# EAGLE design mote+cc3200v7 (EAGLE 9.6.2)

## Sheet 1 of 4: CC3200
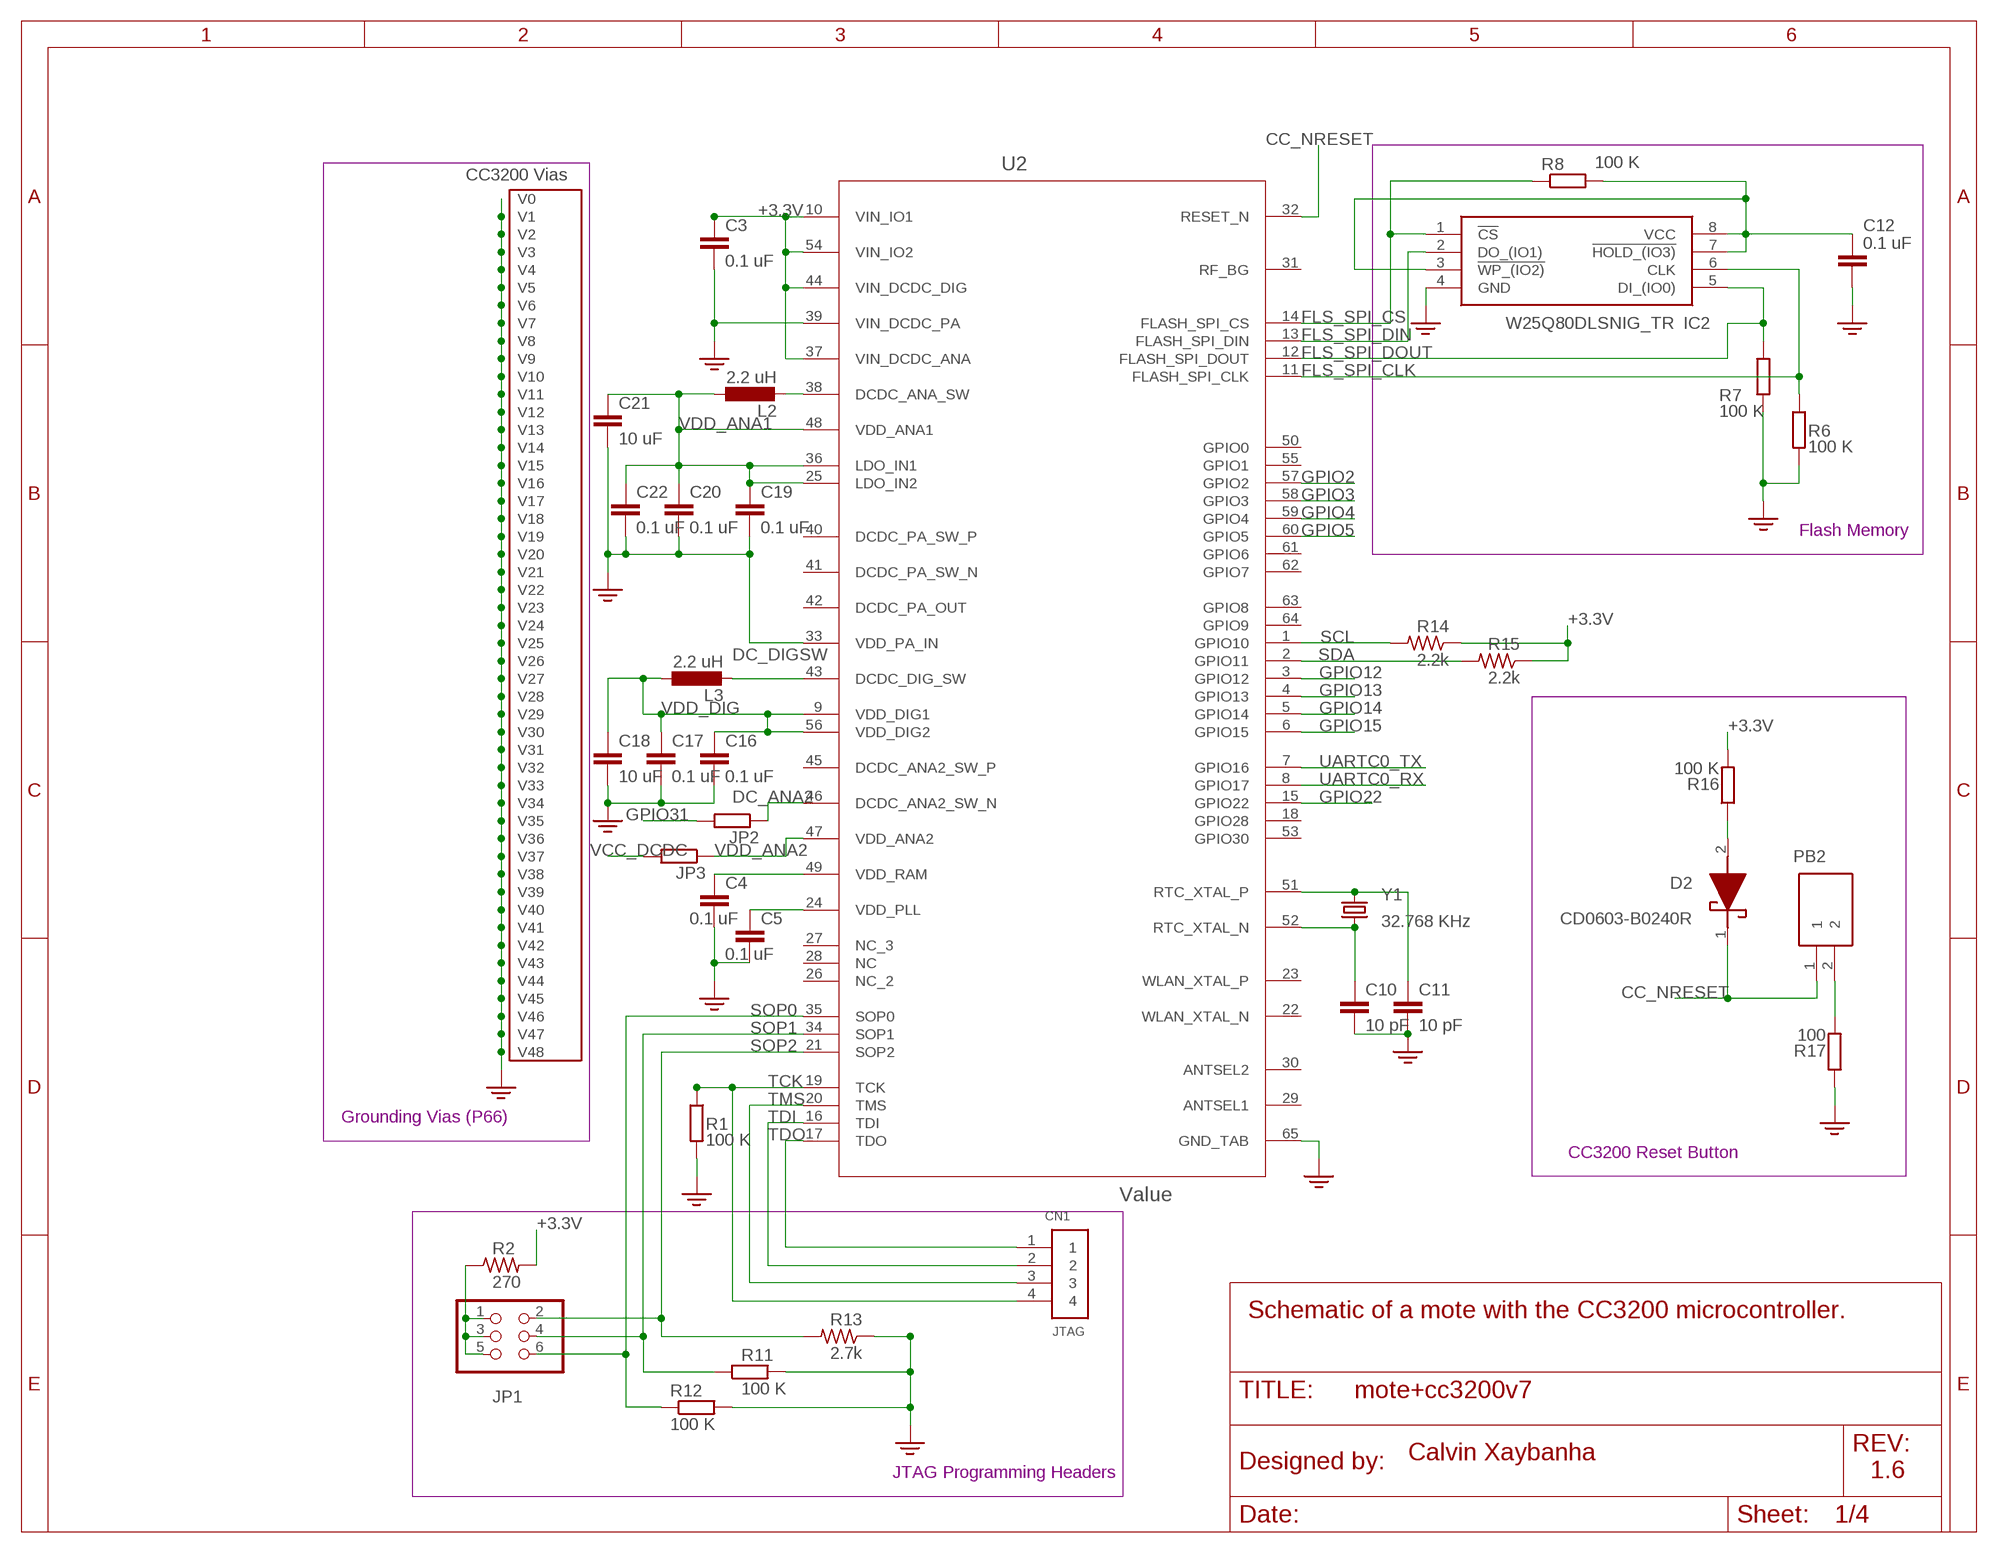
[diagram p0: schematic, sheet 1]
FRAME1 (FRAME_8.5X11): SPICEPREFIX: X

### Parts
C3  0.1 uF  C-EUC1808  [C1808]
C4  0.1 uF  C-EUC1808  [C1808]
C5  0.1 uF  C-EUC1808  [C1808]
C10  10 pF  CC1808  [C1808]
C11  10 pF  CC1808  [C1808]
C12  0.1 uF  C-EUC1808  [C1808]
C16  0.1 uF  C-EUC1808  [C1808]
C17  0.1 uF  C-EUC1808  [C1808]
C18  10 uF  CC1808  [C1808]
C19  0.1 uF  C-EUC1808  [C1808]
C20  0.1 uF  C-EUC1808  [C1808]
C21  10 uF  CC1808  [C1808]
C22  0.1 uF  C-EUC1808  [C1808]
CN1  JTAG  1X4-BIG  [1X04-BIG]
D2  CD0603-B0240R  [CD0603B0240R]
IC2  W25Q80DLSNIG_TR  [SOIC127P600X175-8N]
JP1  PINHD-2X3/90  [2X03/90]
JP2  RR0201  [R0201]
JP3  RR0201  [R0201]
L2  2.2 uH  L-EUL3216C  [L3216C]
L3  2.2 uH  L-EUL3216C  [L3216C]
PB2  FSMSM  [FSMSM]
R1  100 K  R-EU_R1206  [R1206]
R2  270  WSLP1206R0500FEA  [RES_1206]
R6  100 K  R-EU_R1206  [R1206]
R7  100 K  R-EU_R1206  [R1206]
R8  100 K  R-EU_R1206  [R1206]
R11  100 K  R-EU_R1206  [R1206]
R12  100 K  R-EU_R1206  [R1206]
R13  2.7k  WSLP1206R0500FEA  [RES_1206]
R14  2.2k  WSLP1206R0500FEA  [RES_1206]
R15  2.2k  WSLP1206R0500FEA  [RES_1206]
R16  100 K  R-EU_R1206  [R1206]
R17  100  R-EU_R1206  [R1206]
U2  Value  CC3200R1M2RGCR  [RGC0064A]
Y1  32.768 KHz  KX-13  [7.0X5.0]

### Nets
+3.3V [Power]: C3.1 C12.1 IC2.3(!WP_(IO2)) IC2.7(!HOLD_(IO3)) IC2.8(VCC) R2.2 R8.2 R14.1 R15.1 R16.2 U2.10(VIN_IO1) U2.37(VIN_DCDC_ANA) U2.44(VIN_DCDC_DIG) U2.54(VIN_IO2) ; also sheet 2,3,4
CC_NRESET: D2.1(K) PB2.1 U2.32(RESET_N)
D2_P2: D2.2(A) R16.1
DC_ANA2 [Signals]: JP2.1 U2.46(DCDC_ANA2_SW_N)
DC_DIGSW [Signals]: L3.2 U2.43(DCDC_DIG_SW)
FLS_SPI_CLK [Signals]: IC2.6(CLK) R6.1 U2.11(FLASH_SPI_CLK)
FLS_SPI_CS [Signals]: IC2.1(!CS) R8.1 U2.14(FLASH_SPI_CS)
FLS_SPI_DIN [Signals]: IC2.2(DO_(IO1)) U2.13(FLASH_SPI_DIN)
FLS_SPI_DOUT [Signals]: IC2.5(DI_(IO0)) R7.1 U2.12(FLASH_SPI_DOUT)
GND: C3.2 C4.2 C5.2 C10.2 C11.2 C12.2 C16.2 C17.2 C18.2 C19.2 C20.2 C21.2 C22.2 IC2.4(GND) R1.2 R6.2 R7.2 R11.2 R12.2 R13.1 R17.1 U2.33(VDD_PA_IN) U2.39(VIN_DCDC_PA) U2.65(GND_TAB) U2.V(V0) U2.V_1(V1) U2.V_2(V2) U2.V_3(V3) U2.V_4(V4) U2.V_5(V5) U2.V_6(V6) U2.V_7(V7) U2.V_8(V8) U2.V_9(V9) U2.V_10(V10) U2.V_11(V11) U2.V_12(V12) U2.V_13(V13) U2.V_14(V14) U2.V_15(V15) U2.V_16(V16) U2.V_17(V17) U2.V_18(V18) U2.V_19(V19) U2.V_20(V20) U2.V_21(V21) U2.V_22(V22) U2.V_23(V23) U2.V_24(V24) U2.V_25(V25) U2.V_26(V26) U2.V_27(V27) U2.V_28(V28) U2.V_29(V29) U2.V_30(V30) U2.V_31(V31) U2.V_32(V32) U2.V_33(V33) U2.V_34(V34) U2.V_35(V35) U2.V_36(V36) U2.V_37(V37) U2.V_38(V38) U2.V_39(V39) U2.V_40(V40) U2.V_41(V41) U2.V_42(V42) U2.V_43(V43) U2.V_44(V44) U2.V_45(V45) U2.V_46(V46) U2.V_47(V47) U2.V_48(V48) ; supply symbol labelled GND2 ; also sheet 2,3,4
GPIO2 [Signals]: U2.57(GPIO2) ; also sheet 3
GPIO3 [Signals]: U2.58(GPIO3) ; also sheet 3
GPIO4 [Signals]: U2.59(GPIO4) ; also sheet 3
GPIO5 [Signals]: U2.60(GPIO5) ; also sheet 3
GPIO12 [Signals]: U2.3(GPIO12) ; also sheet 3
GPIO13 [Signals]: U2.4(GPIO13) ; also sheet 3
GPIO14 [Signals]: U2.5(GPIO14) ; also sheet 3
GPIO15 [Signals]: U2.6(GPIO15) ; also sheet 3
GPIO22 [Signals]: U2.15(GPIO22) ; also sheet 4
GPIO31 [Signals]: JP2.2
JP1_PWR: JP1.1 JP1.3 JP1.5 R2.1
L2_ANA [Signals]: L2.2 U2.38(DCDC_ANA_SW)
PB2_2: PB2.2 R17.2
SCL [Signals]: R14.2 U2.1(GPIO10) ; also sheet 3
SDA [Signals]: R15.2 U2.2(GPIO11) ; also sheet 3
SOP0 [Signals]: JP1.6 R12.1 U2.35(SOP0)
SOP1 [Signals]: JP1.4 R11.1 U2.34(SOP1)
SOP2 [Signals]: JP1.2 R13.2 U2.21(SOP2)
TCK [Signals]: CN1.4 R1.1 U2.19(TCK)
TDI [Signals]: CN1.2 U2.16(TDI)
TDO [Signals]: CN1.1 U2.17(TDO)
TMS [Signals]: CN1.3 U2.20(TMS)
UARTC0_RX [Signals]: U2.8(GPIO17) ; also sheet 2
UARTC0_TX [Signals]: U2.7(GPIO16) ; also sheet 2
VCC_DCDC [Signals]: JP3.2
VDD_ANA1 [Signals]: C19.1 C20.1 C21.1 C22.1 L2.1 U2.25(LDO_IN2) U2.36(LDO_IN1) U2.48(VDD_ANA1)
VDD_ANA2 [Signals]: JP3.1 U2.47(VDD_ANA2)
VDD_DIG: C16.1 C17.1 C18.1 L3.1 U2.9(VDD_DIG1) U2.56(VDD_DIG2)
VDD_PULL [Signals]: C5.1 U2.24(VDD_PLL)
VDD_RAM [Signals]: C4.1 U2.49(VDD_RAM)
XTAL1 [Signals]: C11.1 U2.51(RTC_XTAL_P) Y1.3
XTAL2 [Signals]: C10.1 U2.52(RTC_XTAL_N) Y1.1
Unconnected: U2.18(GPIO28) U2.22(WLAN_XTAL_N) U2.23(WLAN_XTAL_P) U2.26(NC_2) U2.27(NC_3) U2.28(NC) U2.29(ANTSEL1) U2.30(ANTSEL2) U2.31(RF_BG) U2.45(DCDC_ANA2_SW_P) U2.50(GPIO0) U2.53(GPIO30) U2.55(GPIO1) U2.61(GPIO6) U2.62(GPIO7) U2.63(GPIO8) U2.64(GPIO9)

### Notes on the sheet
- CC3200 Vias
- Flash Memory
- Grounding Vias (P66)
- CC3200 Reset Button
- Schematic of a mote with the CC3200 microcontroller.
- Calvin Xaybanha
- JTAG Programming Headers | 1.6

## Sheet 2 of 4: Smart Mesh
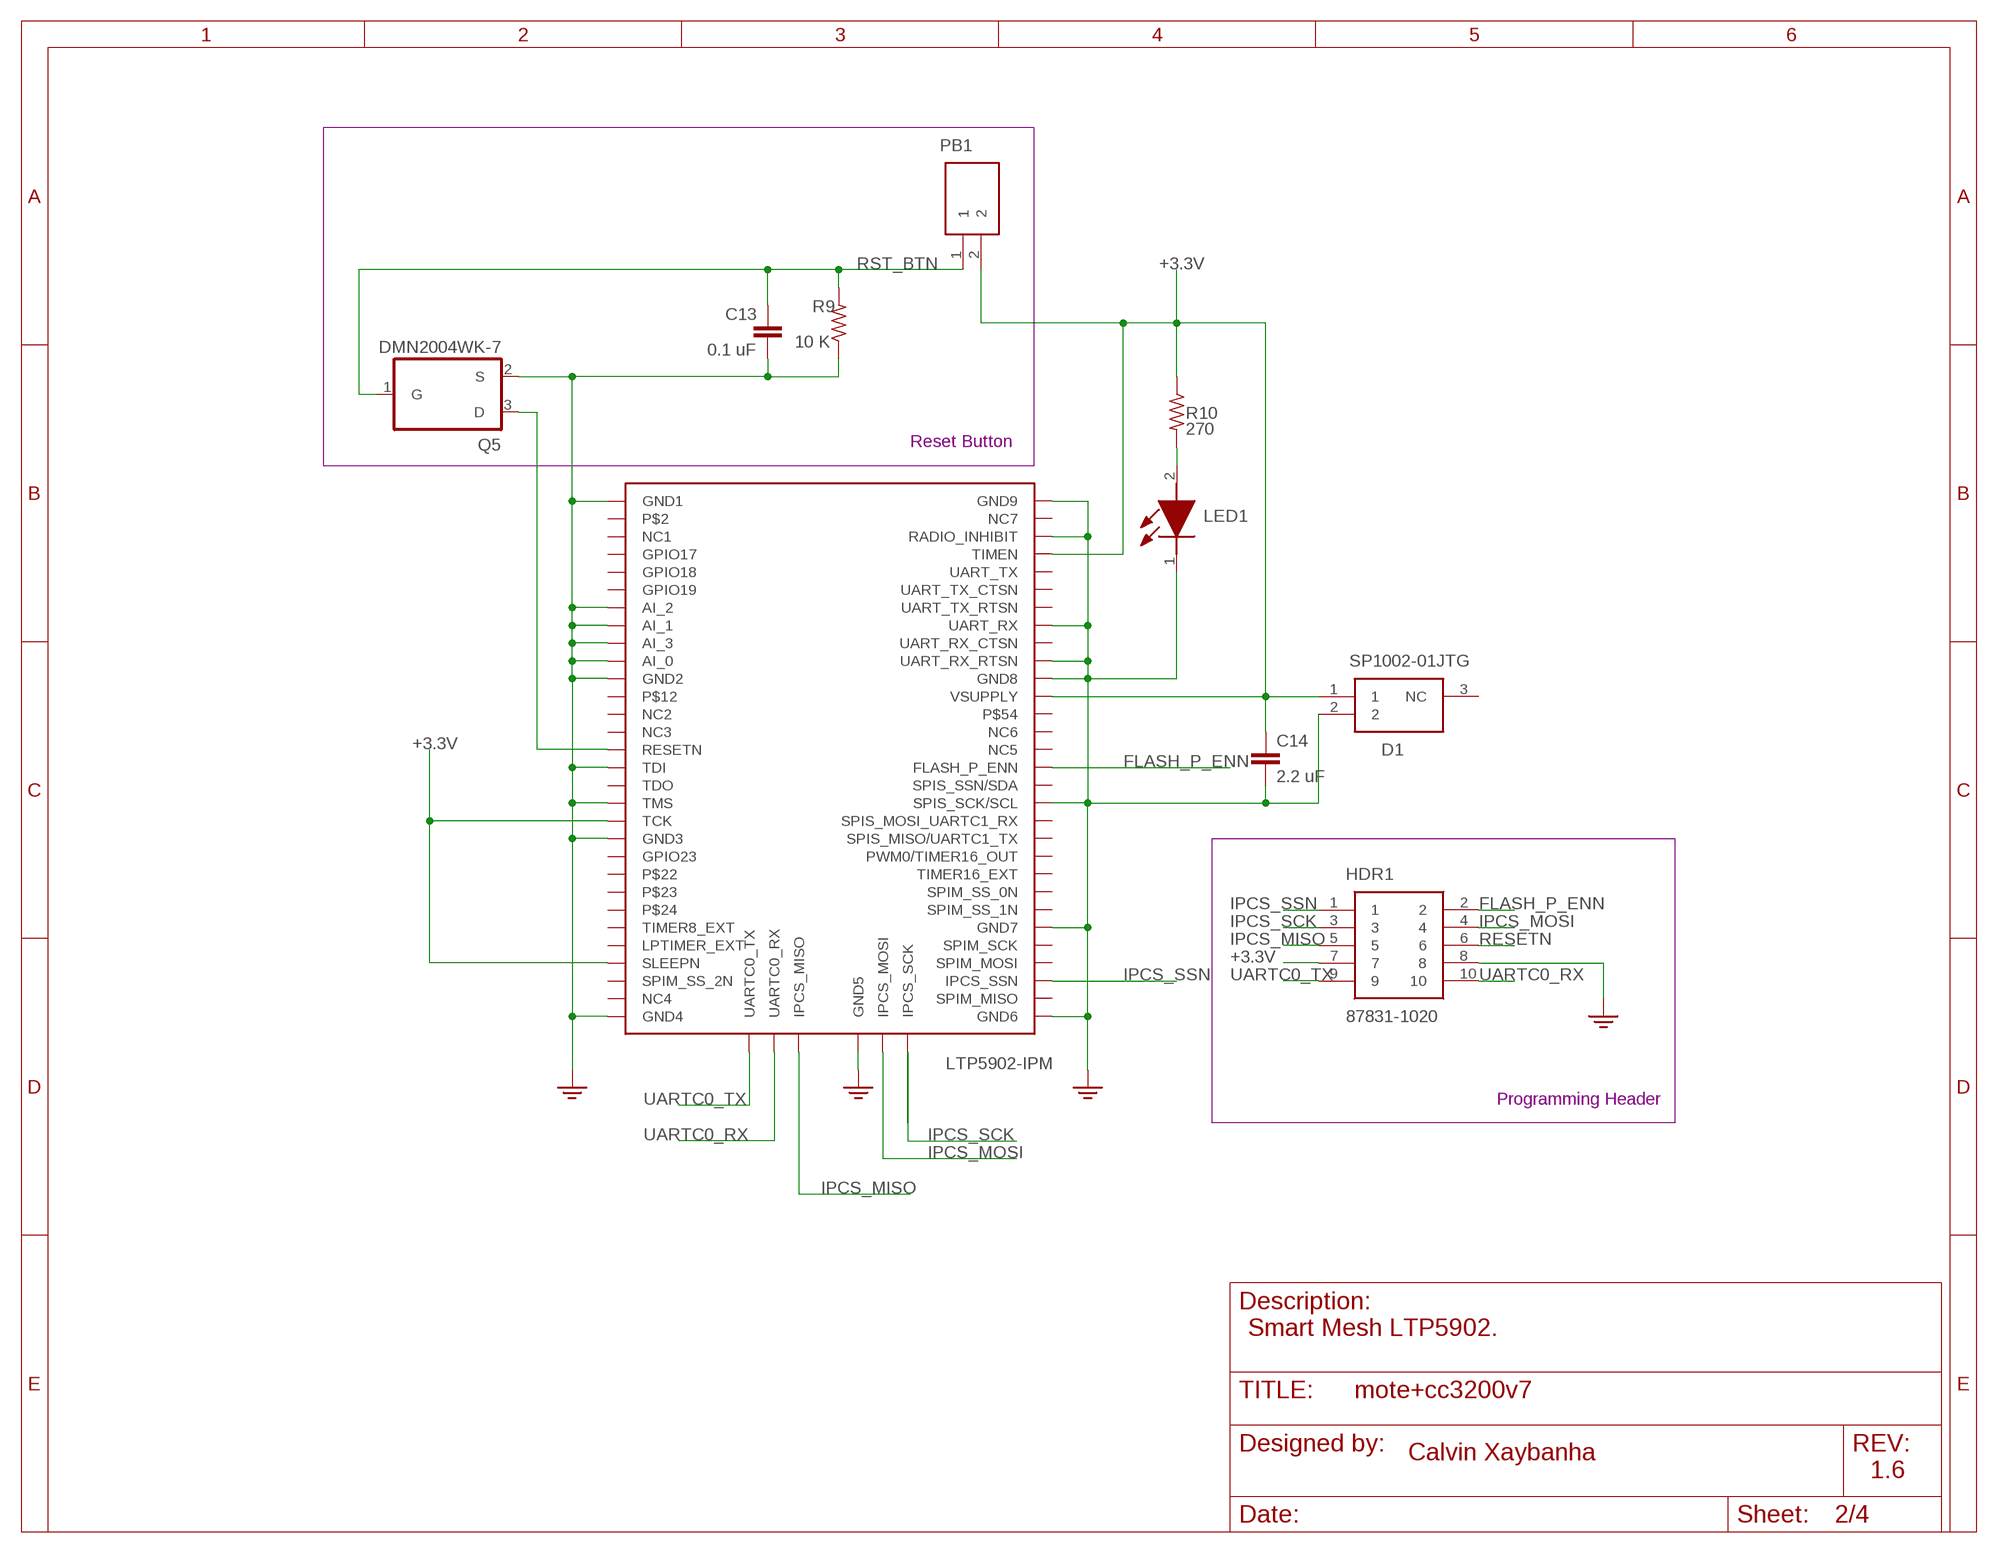
[diagram p1: schematic, sheet 2]

### Parts
C13  0.1 uF  C-EUC1808  [C1808]
C14  2.2 uF  CC1808  [C1808]
D1  SP1002-01JTG  [SOT132P220X110-3N]
HDR1  87831-1020  [SHDR10W55P200_2X5_1265X630X640]
LED1  156120RS75000  [LEDM3216X130N]
PB1  FSMSM  [FSMSM]
Q5  DMN2004WK-7  [SC70-3_DCK]
R9  10 K  WSLP1206R0500FEA  [RES_1206]
R10  270  WSLP1206R0500FEA  [RES_1206]
U3  LTP5902  [LTP5902-MMCX]

### Nets
+3.3V [Power]: C14.1 D1.1 HDR1.7 PB1.2 R10.1 U3.P19(TCK) U3.P27(SLEEPN) U3.P55(VSUPPLY) U3.P63(TIMEN) ; also sheet 1,3,4
FLASH_P_ENN [Signals]: HDR1.2 U3.P51(FLASH_P_ENN)
GND: C13.2 C14.2 D1.2 HDR1.8 LED1.1(K) Q5.2(S) R9.1 U3.P1(GND1) U3.P7(AI_2) U3.P8(AI_1) U3.P9(AI_3) U3.P10(AI_0) U3.P11(GND2) U3.P16(TDI) U3.P18(TMS) U3.P20(GND3) U3.P30(GND4) U3.P34(GND5) U3.P37(GND6) U3.P42(GND7) U3.P49(SPIS_SCK/SCL) U3.P56(GND8) U3.P57(UART_RX_RTSN) U3.P59(UART_RX) U3.P64(RADIO_INHIBIT) U3.P66(GND9) ; supply symbol labelled GND2 ; also sheet 1,3,4
IPCS_MISO [Signals]: HDR1.5 U3.P33(IPCS_MISO)
IPCS_MOSI [Signals]: HDR1.4 U3.P35(IPCS_MOSI)
IPCS_SCK [Signals]: HDR1.3 U3.P36(IPCS_SCK)
IPCS_SSN [Signals]: HDR1.1 U3.P39(IPCS_SSN)
LED1 [Signals]: LED1.2(A) R10.2
RESETN [Signals]: HDR1.6 Q5.3(D) U3.P15(RESETN)
RST_BTN [Signals]: C13.1 PB1.1 Q5.1(G) R9.2
UARTC0_RX [Signals]: HDR1.10 U3.P32(UARTC0_RX) ; also sheet 1
UARTC0_TX [Signals]: HDR1.9 U3.P31(UARTC0_TX) ; also sheet 1
Unconnected: D1.3(NC) U3.P2 U3.P3(NC1) U3.P4(GPIO17) U3.P5(GPIO18) U3.P6(GPIO19) U3.P12 U3.P13(NC2) U3.P14(NC3) U3.P17(TDO) U3.P21(GPIO23) U3.P22 U3.P23 U3.P24 U3.P25(TIMER8_EXT) U3.P26(LPTIMER_EXT) U3.P28(SPIM_SS_2N) U3.P29(NC4) U3.P38(SPIM_MISO) U3.P40(SPIM_MOSI) U3.P41(SPIM_SCK) U3.P43(SPIM_SS_1N) U3.P44(SPIM_SS_0N) U3.P45(TIMER16_EXT) U3.P46(PWM0/TIMER16_OUT) U3.P47(SPIS_MISO/UARTC1_TX) U3.P48(SPIS_MOSI_UARTC1_RX) U3.P50(SPIS_SSN/SDA) U3.P52(NC5) U3.P53(NC6) U3.P54 U3.P58(UART_RX_CTSN) U3.P60(UART_TX_RTSN) U3.P61(UART_TX_CTSN) U3.P62(UART_TX) U3.P65(NC7)

### Notes on the sheet
- Reset Button
- LTP5902-IPM
- Programming Header
- Smart Mesh LTP5902.
- Calvin Xaybanha
- 1.6

## Sheet 3 of 4: Sensors
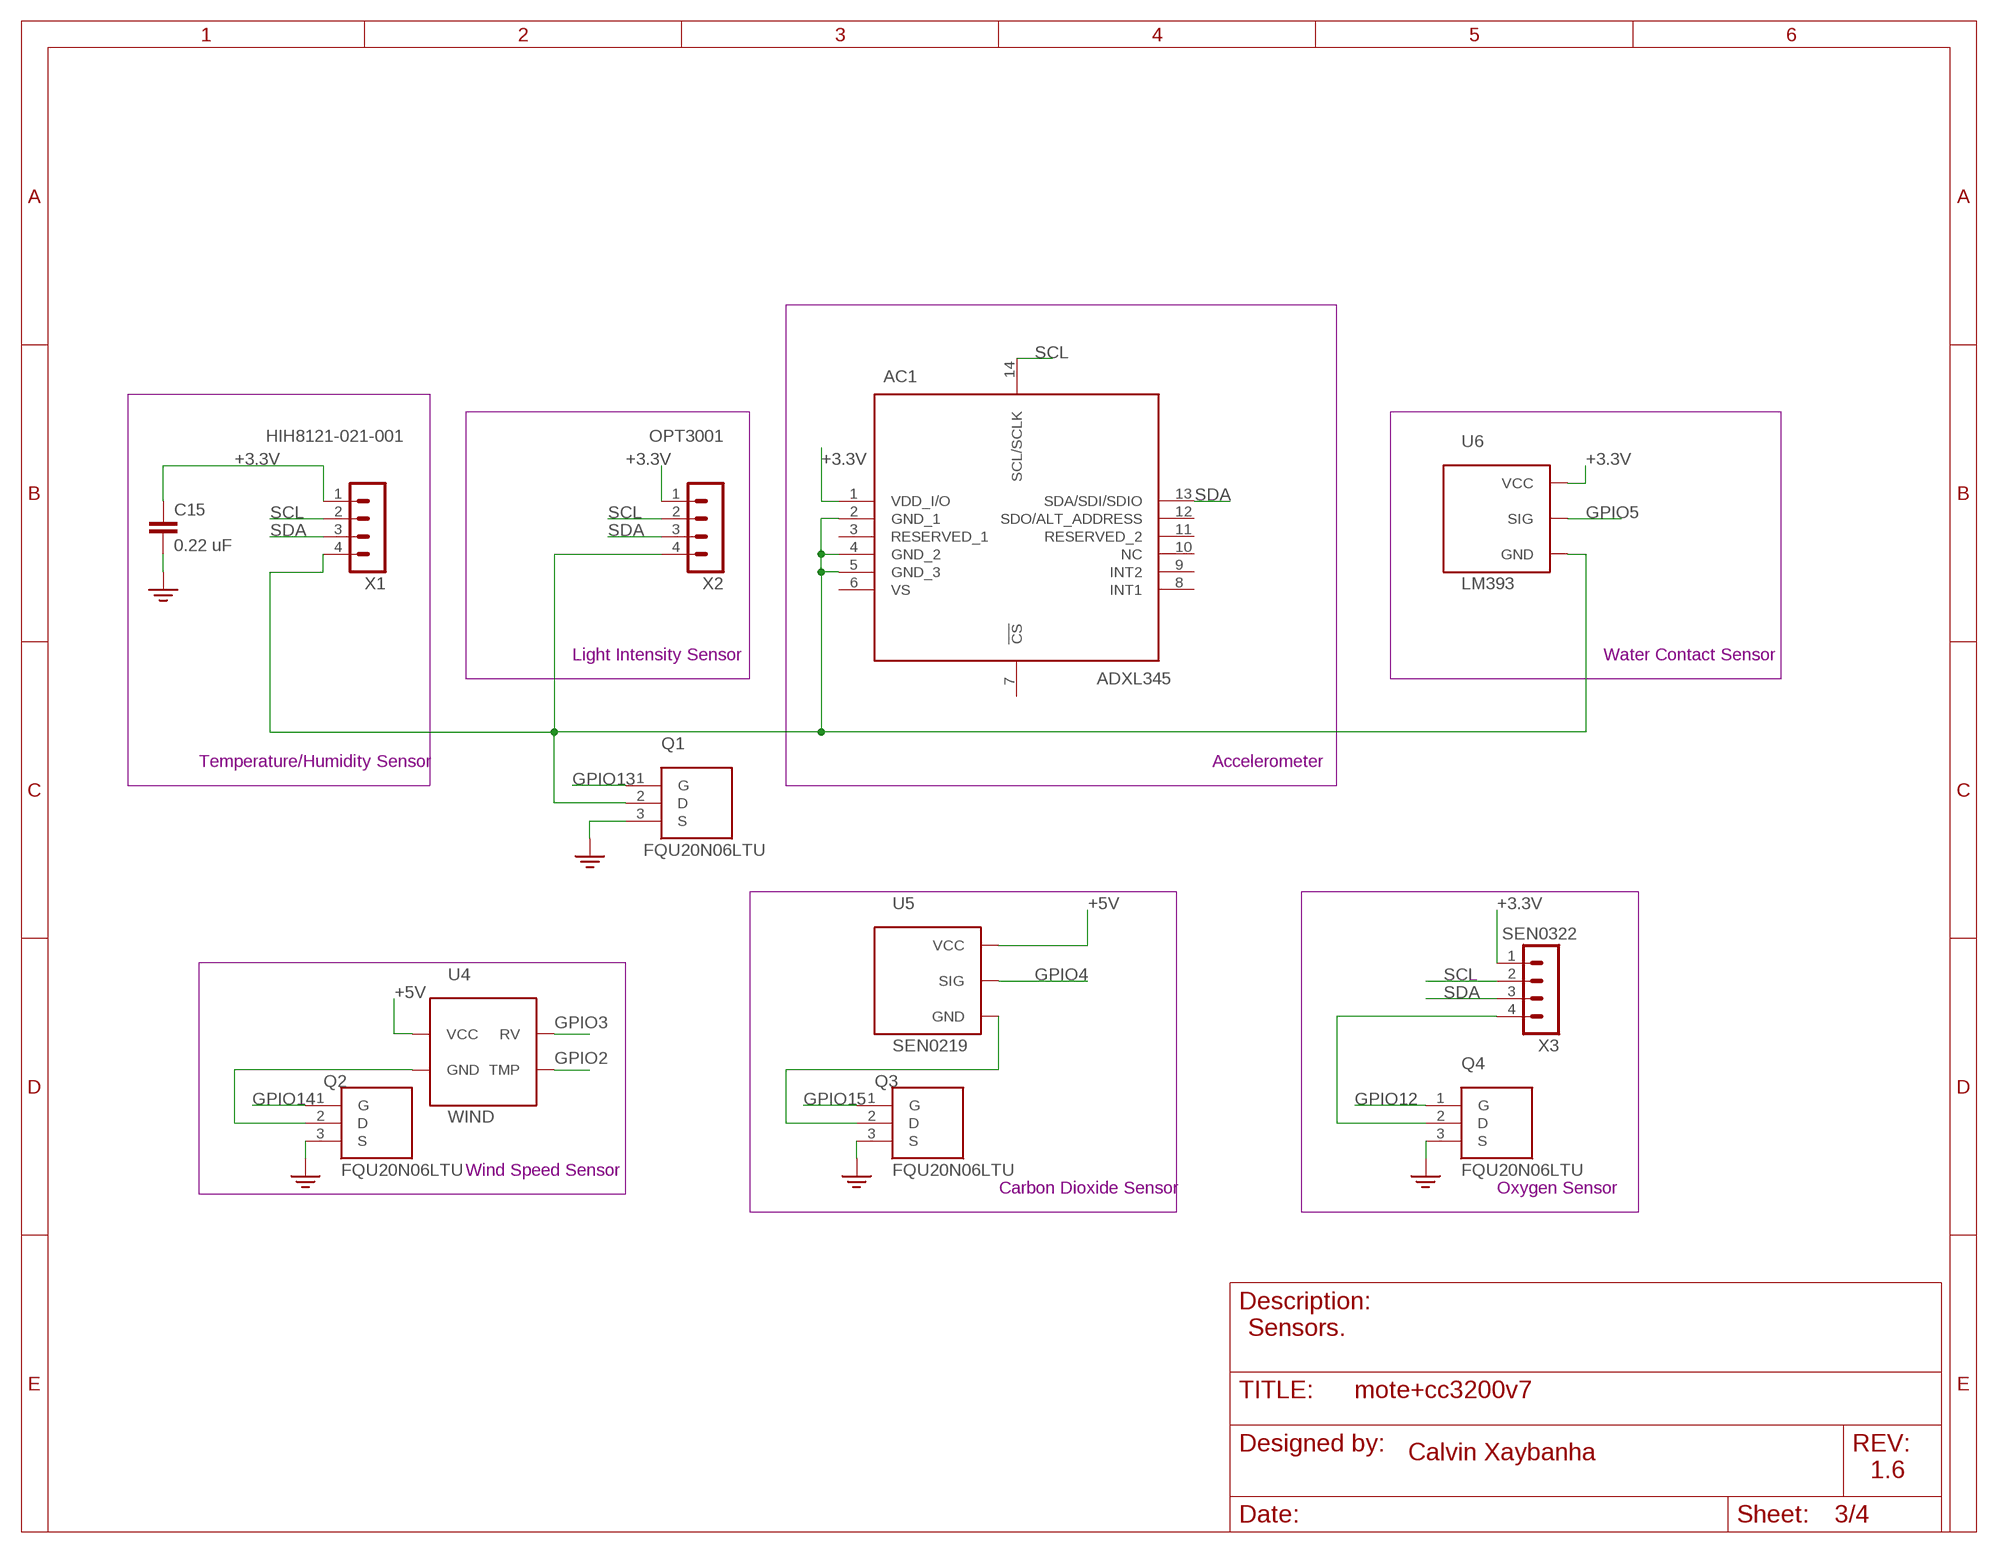
[diagram p2: schematic, sheet 3]

### Parts
AC1  ADXL345  [CC-14-1]
C15  0.22 uF  C5/3.5  [C5B3.5]
Q1  FQU20N06LTU  [TO229P250X658X985-3P]
Q2  FQU20N06LTU  [TO229P250X658X985-3P]
Q3  FQU20N06LTU  [TO229P250X658X985-3P]
Q4  FQU20N06LTU  [TO229P250X658X985-3P]
U4  WIND  [WIND]
U5  SEN0219  [SEN0219]
U6  LM393  [LM393]
X1  HIH8121-021-001  B4B-PH-K-S  [B4B-PH-K-S]
X2  OPT3001  B4B-PH-K-S  [B4B-PH-K-S]
X3  SEN0322  B4B-PH-K-S  [B4B-PH-K-S]

### Nets
+3.3V [Power]: AC1.1(VDD_I/O) C15.1 U6.P$1(VCC) X1.1 X2.1 X3.1 ; also sheet 1,2,4
+5V [Power]: U4.P$1(VCC) U5.P$1(VCC) ; also sheet 4
GND: C15.2 Q1.3(S) Q2.3(S) Q3.3(S) Q4.3(S) ; supply symbol labelled GND2 ; also sheet 1,2,4
GPIO2 [Signals]: U4.P$4(TMP) ; also sheet 1
GPIO3 [Signals]: U4.P$3(RV) ; also sheet 1
GPIO4 [Signals]: U5.P$2(SIG) ; also sheet 1
GPIO5 [Signals]: U6.P$2(SIG) ; also sheet 1
GPIO12 [Signals]: Q4.1(G) ; also sheet 1
GPIO13 [Signals]: Q1.1(G) ; also sheet 1
GPIO14 [Signals]: Q2.1(G) ; also sheet 1
GPIO15 [Signals]: Q3.1(G) ; also sheet 1
Q1+ [Signals]: AC1.2(GND_1) AC1.4(GND_2) AC1.5(GND_3) Q1.2(D) U6.P$3(GND) X1.4 X2.4
Q2+ [Signals]: Q2.2(D) U4.P$2(GND)
Q3+ [Signals]: Q3.2(D) U5.P$3(GND)
Q4+ [Signals]: Q4.2(D) X3.4
SCL [Signals]: AC1.14(SCL/SCLK) X1.2 X2.2 X3.2 ; also sheet 1
SDA [Signals]: AC1.13(SDA/SDI/SDIO) X1.3 X2.3 X3.3 ; also sheet 1
Unconnected: AC1.3(RESERVED_1) AC1.6(VS) AC1.7(!CS) AC1.8(INT1) AC1.9(INT2) AC1.10(NC) AC1.11(RESERVED_2) AC1.12(SDO/ALT_ADDRESS)

### Notes on the sheet
- Light Intensity Sensor | Water Contact Sensor
- Temperature/Humidity Sensor | Accelerometer
- Wind Speed Sensor
- Carbon Dioxide Sensor | Oxygen Sensor
- Sensors.
- Calvin Xaybanha
- 1.6

## Sheet 4 of 4: Power Supply
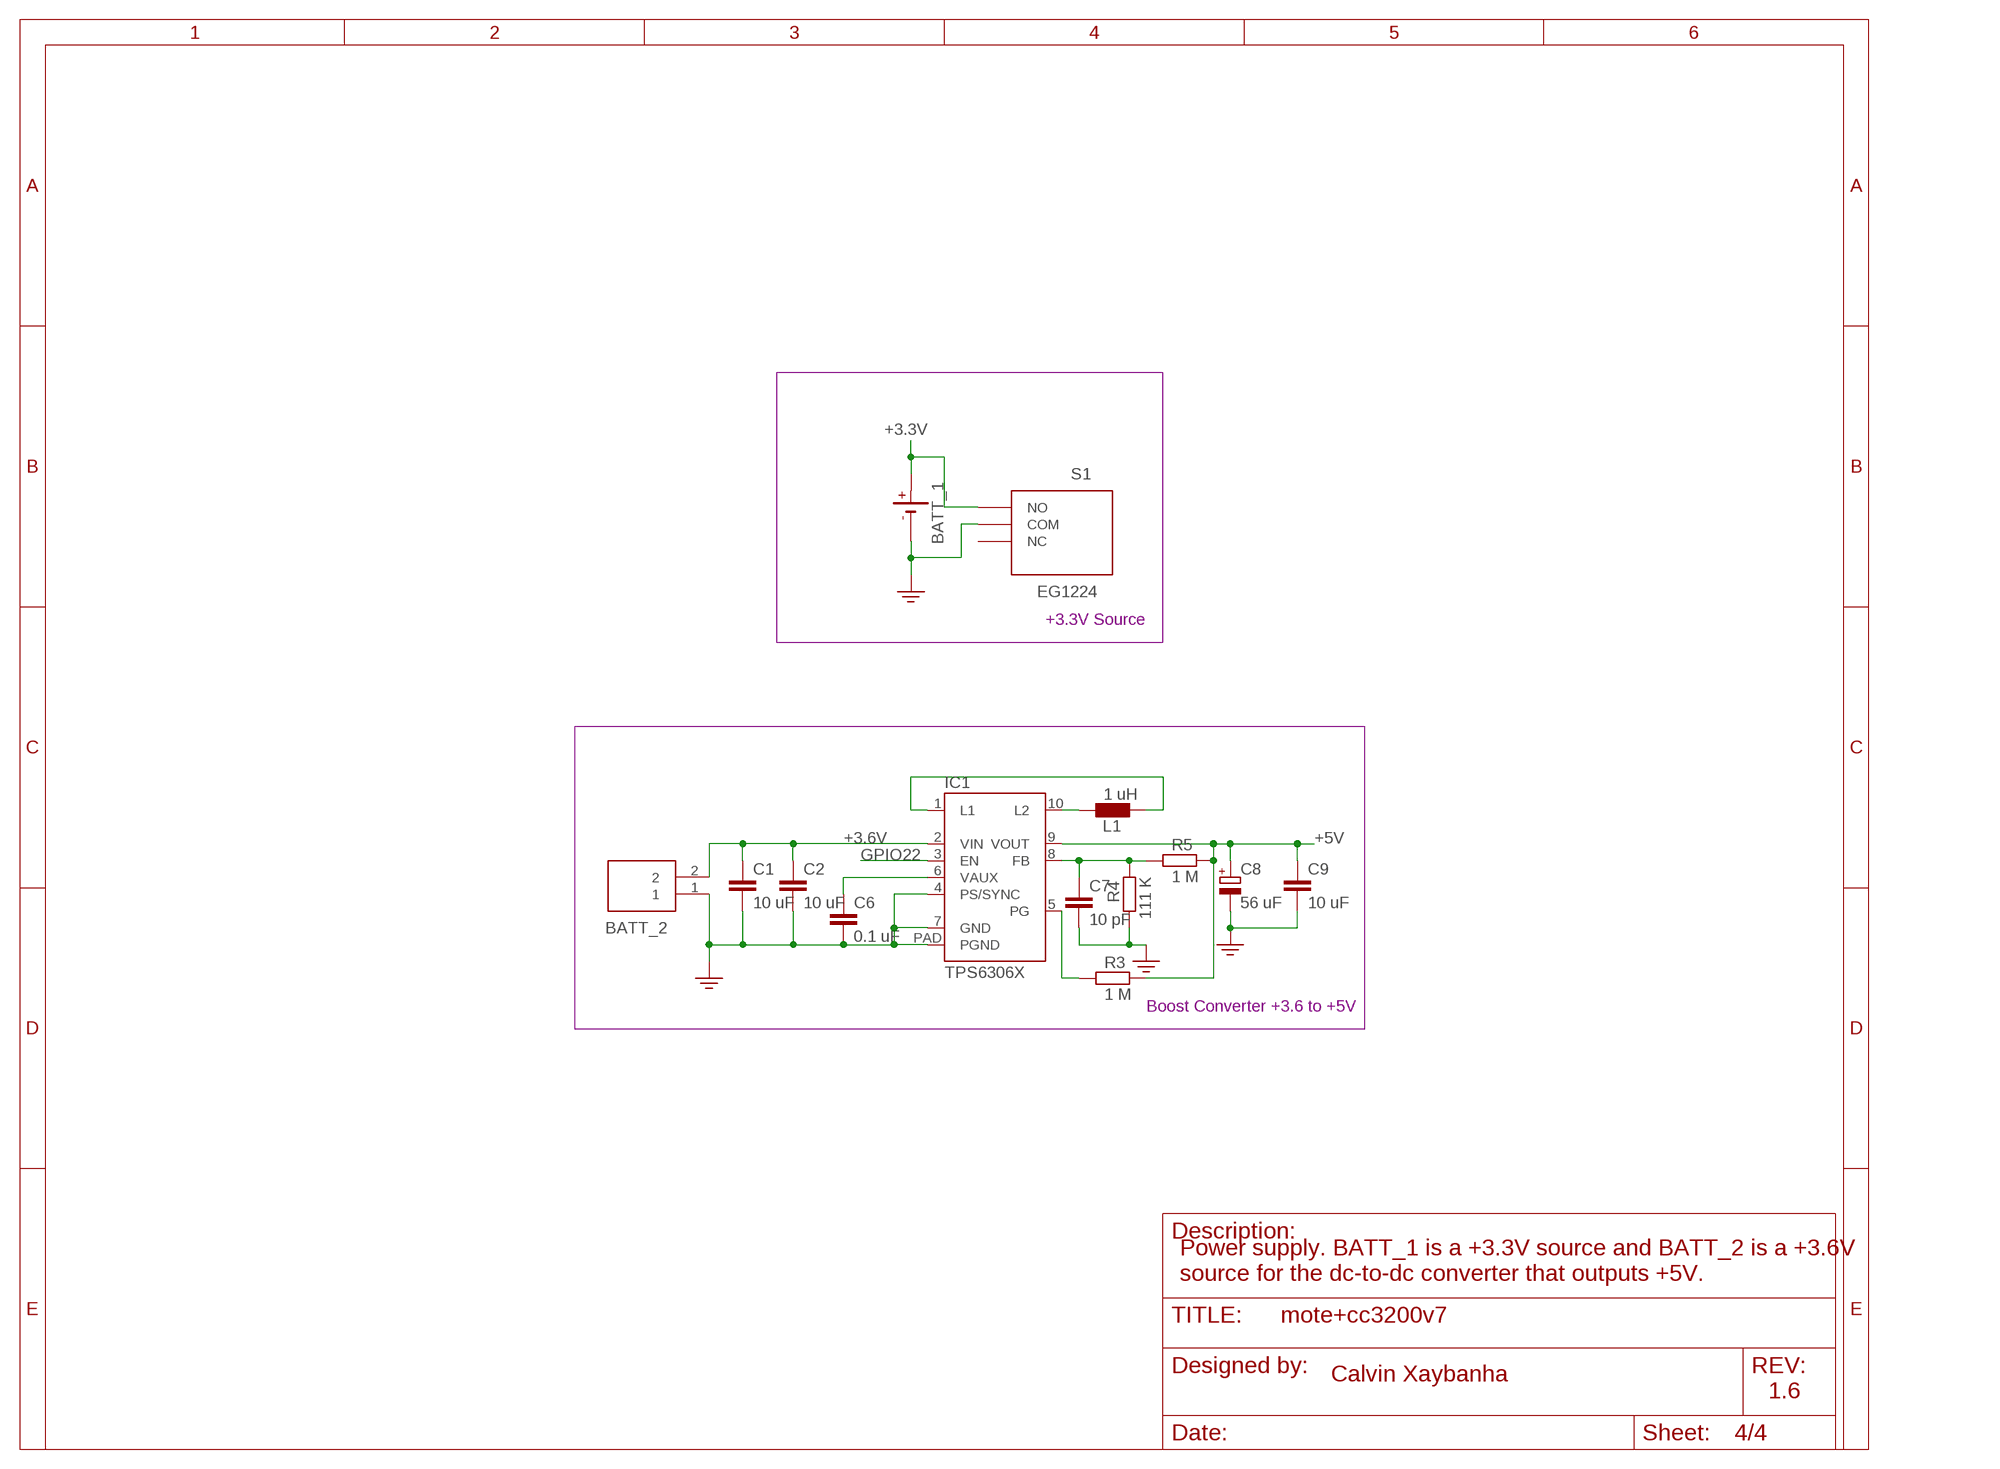
[diagram p3: schematic, sheet 4]

### Parts
BATT_1  BATTERY_BR1225/FA  [BATTERY_BR1225/FA]
BATT_2  12BH23P-GR  [12BH23PGR]
C1  10 uF  CC1808  [C1808]
C2  10 uF  CC1808  [C1808]
C6  0.1 uF  C-EUC1808  [C1808]
C7  10 pF  CC1808  [C1808]
C8  56 uF  CPOL-EUE3.5-8  [E3,5-8]
C9  10 uF  CC1808  [C1808]
IC1  TPS6306X  [S-PWSON-N10]
L1  1 uH  L0204/7  [0204/7]
R3  1 M  R-EU_R5025  [R5025]
R4  111 K  R-EU_R1206  [R1206]
R5  1 M  R-EU_R5025  [R5025]
S1  EG1224  [EG1224]

### Nets
+3.3V [Power]: BATT_1.+ S1.1(NO) ; also sheet 1,2,3
+3.6V [Power]: BATT_2.2 C1.1 C2.1 IC1.2(VIN)
+5V [Power]: C8.+ C9.1 IC1.9(VOUT) R3.2 R5.2 ; also sheet 3
FB_TPS [Signals]: C7.1 IC1.8(FB) R4.2 R5.1
GND: BATT_1.- BATT_2.1 C1.2 C2.2 C6.2 C7.2 C8.- C9.2 IC1.4(PS/SYNC) IC1.7(GND) IC1.PAD(PGND) R4.1 S1.2(COM) ; supply symbol labelled GND2 ; also sheet 1,2,3
GPIO22 [Signals]: IC1.3(EN) ; also sheet 1
L_TPS1 [Signals]: IC1.1(L1) L1.2
L_TPS2 [Signals]: IC1.10(L2) L1.1
PG_TPS [Signals]: IC1.5(PG) R3.1
VAUX_TPS [Signals]: C6.1 IC1.6(VAUX)
Unconnected: S1.3(NC) S1.MH1 S1.MH2 S1.MH3 S1.MH4

### Notes on the sheet
- +3.3V Source
- Boost Converter +3.6 to +5V
- Power supply. BATT_1 is a +3.3V source and BATT_2 is a +3.6V 
  source for the dc-to-dc converter that outputs +5V.
- Calvin Xaybanha
- 1.6

## Power pins joined to a net without a drawn wire
DCDC_PA_OUT: U2.42(DCDC_PA_OUT)
DCDC_PA_SW_N: U2.41(DCDC_PA_SW_N)
DCDC_PA_SW_P: U2.40(DCDC_PA_SW_P)

## Library data of the parts
AC1 = ADXL345:ADXL345: 3-Axis Accelerometer IC Source: Datasheet <http://www.analog.com/media/en/technical-documentation/data-sheets/ADXL345.pdf>; DESCRIPTION: 3-Axis Accelerometer IC; HEIGHT: mm; MANUFACTURER_NAME: Analog Devices; MANUFACTURER_PART_NUMBER: ADXL345; MOUSER_PART_NUMBER: N/A; MOUSER_PRICE-STOCK: https://www.mouser.co.uk/ProductDetail/Analog-Devices/ADXL345?qs=5aG0NVq1C4y%252BItyqaAF9pQ%3D%3D
BATT_1 = 52101-101-REV-A_v16:BATTERY_BR1225/FA: BATT LITH COIN 3V
BATT_2 = SamacSys_Parts:12BH23P-GR: Cylindrical Battery Contacts, Clips, Holders & Springs CR123A HOLDER Source: Datasheet <https://www.mouser.co.uk/datasheet/2/209/Eagle_032917_12BH23P-GR_EPD-200981-1171083.pdf>; DESCRIPTION: Cylindrical Battery Contacts, Clips, Holders & Springs CR123A HOLDER; HEIGHT: 15.6mm; MANUFACTURER_NAME: Eagle Plastic Devices; MANUFACTURER_PART_NUMBER: 12BH23P-GR; MOUSER_PART_NUMBER: 12BH23P-GR; MOUSER_PRICE-STOCK: https://www.mouser.co.uk/ProductDetail/Eagle-Plastic-Devices/12BH23P-GR/?qs=AQlKX63v8RtoPEbnxYQ6dg%3D%3D
C1 C2 C7 C9-C11 C14 C18 C21 = eagle-ltspice:C: CAPACITOR, European symbol; SPICEMODEL: NONE; SPICEPREFIX: C
C3-C6 C12 C13 C16 C17 C19 C20 C22 = rcl:C-EU: CAPACITOR, European symbol; SPICEPREFIX: C
C8 = rcl:CPOL-EU: POLARIZED CAPACITOR, European symbol; SPICEPREFIX: C
C15 = capacitor-wima:C: CAPACITOR naming: grid - package width
CN1 = adafruit:1X4: 4-pin connector
D1 = SamacSys_Parts:SP1002-01JTG: Littelfuse SP1002-01JTG, Dual-Element Bi-Directional TVS Diode Array, 3-Pin SC-70 Source: Datasheet <https://www.littelfuse.com/~/media/electronics/datasheets/tvs_diode_arrays/littelfuse_tvs_diode_array_sp1002_datasheet.pdf.pdf>; DESCRIPTION: Littelfuse SP1002-01JTG, Dual-Element Bi-Directional TVS Diode Array, 3-Pin SC-70; HEIGHT: 1.1mm; MANUFACTURER_NAME: LITTELFUSE; MANUFACTURER_PART_NUMBER: SP1002-01JTG; MOUSER_PART_NUMBER: 576-SP1002-01JTG; MOUSER_PRICE-STOCK: https://www.mouser.co.uk/ProductDetail/Littelfuse/SP1002-01JTG?qs=Xb8IjHhkxj6pIS6%252BgvMqKQ%3D%3D
D2 = CD0603-B0240R:CD0603-B0240R: Diode Small Signal Schottky 40V 0.2A Automotive 2-Pin Case 0603(1608Metric) T/R Source: Datasheet <https://www.bourns.com/docs/product-datasheets/cd0603-b.pdf>; DESCRIPTION: Diode Small Signal Schottky 40V 0.2A Automotive 2-Pin Case 0603(1608Metric) T/R; HEIGHT: mm; MANUFACTURER_NAME: Bourns; MANUFACTURER_PART_NUMBER: CD0603-B0240R; MOUSER_PART_NUMBER: 652-CD0603-B0240R; MOUSER_PRICE-STOCK: https://www.mouser.co.uk/ProductDetail/Bourns/CD0603-B0240R?qs=xhbEVWpZdWfKFVW2dTkPtA%3D%3D
HDR1 = SamacSys_Parts:87831-1020: Header 2.00mm Milli-Grid, vert, TH, 10w Molex MILLI-GRID Series, Series Number 87831, 2mm Pitch 10 Way 2 Row Straight PCB Header, Solder Termination, 2A Source: Datasheet; DESCRIPTION: Header 2.00mm Milli-Grid, vert, TH, 10w Molex MILLI-GRID Series, Series Number 87831, 2mm Pitch 10 Way 2 Row Straight PCB Header, Solder Termination, 2A; HEIGHT: 6.4mm; MANUFACTURER_NAME: Molex; MANUFACTURER_PART_NUMBER: 87831-1020; MOUSER_PART_NUMBER: 538-87831-1020; MOUSER_PRICE-STOCK: https://www.mouser.co.uk/ProductDetail/Molex/87831-1020?qs=8PELaTI4Pt8k%2F%2FV9vKeYIg%3D%3D
IC1 = m_vreg:TPS6306X: TPS6306x High Input Voltage, Buck-Boost Converter With 2-A Switch Current Features Input Voltage Range: 2.5 V to 12 V Efficiency: Up to 93% Output Current at 5 V (VIN<10 V): 2 A in Buck Mode Output Current at 5 V (VIN>4 V): 1.3 A in Boost Mode Automatic Transition Between Step Down and Boost Mode Typical Device Quiescent Current: < 30 μA Fixed and Adjustable Output Voltage Options from 2.5 V to 8 V Power-Save Mode for Improved Efficiency at Low Output Power Forced Fixed-Frequency Operation at 2.4 MHz and Synchronization Possible Power Good Output Buck-Boost Overlap ControlTM Load Disconnect During Shutdown Overtemperature Protection Overvoltage Protection Description The TPS6306x devices provide a power supply solution for products powered by either three-cell up to six-cell alkaline, NiCd or NiMH battery, or a one- cell or dual-cell Li-Ion or Li-polymer battery. Output currents can go as high as 2-A while using a dual-cell Li-Ion or Li-polymer battery, and discharge it down to 5 V or lower. The buck-boost converter is based on a fixed frequency, pulse-width-modulation (PWM) controller using synchronous rectification to obtain maximum efficiency. At low load currents, the converter enters power-save mode to maintain high efficiency over a wide load current range. The power- save mode can be disabled, forcing the converter to operate at a fixed switching frequency. The maximum average current in the switches is limited to a typical value of 2.25 A. The output voltage is programmable using an external resistor divider, or is fixed internally on the chip. The converter can be disabled to minimize battery drain. During shutdown, the load is disconnected from the battery. The devices are available in a 3 mm × 3 mm, 10-pin, WSON (DSC), PowerPADTM package. Information based on TI document SLVSA92B – DECEMBER 2011 – REVISED DECEMBER 2014 Added 2016-07-24; MANUF: TI; PARTNUM: TPS6306X
IC2 = SamacSys_Parts:W25Q80DLSNIG_TR: 2.5V AND 3V 8M-BIT SERIAL FLASH MEMORY WITH DUAL AND QUAD SPI Source: Datasheet <https://www.winbond.com/resource-files/w25q80dv dl_revh_10022015.pdf>; DESCRIPTION: 2.5V AND 3V 8M-BIT SERIAL FLASH MEMORY WITH DUAL AND QUAD SPI; HEIGHT: 1.75mm; MANUFACTURER_NAME: Winbond; MANUFACTURER_PART_NUMBER: W25Q80DLSNIG TR; MOUSER_PART_NUMBER: 454-W25Q80DLSNIGTR; MOUSER_PRICE-STOCK: https://www.mouser.co.uk/ProductDetail/Winbond/W25Q80DLSNIG-TR?qs=qSfuJ%252Bfl%2Fd4EQ3sPamYlCg%3D%3D
JP1 = pinhead:PINHD-2X3: PIN HEADER
JP2 JP3 = eagle-ltspice:R: RESISTOR, European symbol; SPICEMODEL: NONE; SPICEPREFIX: R
L1 = eagle-ltspice:L: INDUCTOR, European symbol; SPICEMODEL: NONE; SPICEPREFIX: L
L2 L3 = rcl:L-EU: INDUCTOR, European symbol; SPICEPREFIX: L
LED1 = SamacSys_Parts:156120RS75000: Wurth Elektronik 156120RS75000, WL-SMRW Series Red LED, 624 nm, 3216 (1206) Clear, Rectangle Lens SMD Package Source: Datasheet <https://katalog.we-online.com/led/datasheet/156120RS75000.pdf>; DESCRIPTION: Wurth Elektronik 156120RS75000, WL-SMRW Series Red LED, 624 nm, 3216 (1206) Clear, Rectangle Lens SMD Package; HEIGHT: 1.3mm; MANUFACTURER_NAME: Wurth Elektronik; MANUFACTURER_PART_NUMBER: 156120RS75000; MOUSER_PART_NUMBER: 710-156120RS75000; MOUSER_PRICE-STOCK: https://www.mouser.co.uk/ProductDetail/Wurth-Elektronik/156120RS75000?qs=2kOmHSv6VfTlw4DhG%252BTIQw%3D%3D
PB1 PB2 = SamacSys_Parts:FSMSM: Tactile switch,SMT,SPST,rect black act Black Button Tactile Switch, SPST 50 mA@ 24 V dc 1.07mm Source: Datasheet; DESCRIPTION: Tactile switch,SMT,SPST,rect black act Black Button Tactile Switch, SPST 50 mA@ 24 V dc 1.07mm; HEIGHT: mm; MANUFACTURER_NAME: TE Connectivity; MANUFACTURER_PART_NUMBER: FSMSM; MOUSER_PART_NUMBER: 506-FSMSM; MOUSER_PRICE-STOCK: https://www.mouser.co.uk/ProductDetail/TE-Connectivity-Alcoswitch/FSMSM?qs=UhRTNahLC3yPLf3YjzjKAA%3D%3D
Q1-Q4 = SamacSys_Parts:FQU20N06LTU: Trans MOSFET N-CH 60V 17.2A 3-Pin IPAK Source: Datasheet <https://www.fairchildsemi.com/datasheets/FQ/FQU20N06L.pdf>; DESCRIPTION: Trans MOSFET N-CH 60V 17.2A 3-Pin IPAK; HEIGHT: 2.5mm; MANUFACTURER_NAME: ON Semiconductor; MANUFACTURER_PART_NUMBER: FQU20N06LTU; MOUSER_PART_NUMBER: 512-FQU20N06LTU; MOUSER_PRICE-STOCK: https://www.mouser.co.uk/ProductDetail/ON-Semiconductor-Fairchild/FQU20N06LTU?qs=bfRUmXT2lZisvT2ROxlO3Q%3D%3D
Q5 = SamacSys_Parts:DMN2004WK-7
R1 R3-R8 R11 R12 R16 R17 = rcl:R-EU_: RESISTOR, European symbol; SPICEPREFIX: R
R2 R9 R10 R13-R15 = Resistor_Capacitor:WSLP1206R0500FEA: RES 0.05 OHM 1% 1W 1206 Manufacturer's datasheet <http://www.vishay.com/docs/30122/wslp.pdf>; CREATED_BY: PCBLayout.com; DIGIKEY_PART_NUMBER: WSLP-.05TR-ND; MANUFACTURER: Vishay Dale; MPN: WSLP1206R0500FEA; PACKAGE: SMD 1206
S1 = SamacSys_Parts:EG1224: E-SWITCH - EG1224 - SWITCH, SLIDE, SPDT, 500mA, 15V, PCB Source: Datasheet; DESCRIPTION: E-SWITCH - EG1224 - SWITCH, SLIDE, SPDT, 500mA, 15V, PCB; HEIGHT: 8.5mm; MANUFACTURER_NAME: E-Switch; MANUFACTURER_PART_NUMBER: EG1224; MOUSER_PART_NUMBER: 612-EG1224; MOUSER_PRICE-STOCK: https://www.mouser.co.uk/ProductDetail/E-Switch/EG1224/?qs=HKd%2Fp3M7KlUMARNITVNimA%3D%3D
U2 = CC3200:CC3200R1M2RGCR; ALTERNATEPARTNUMBER: CC3200R1M2RGC; COMPTYPE: IC; MANUFACTURER: Texas Instruments; MOUNTTYPE: SMT; PACKAGEREFERENCE: RGC0064A; PARTNUMBER: CC3200R1M2RGCR; PIN_COUNT: 65; REFDES: RefDes; ROHS: Y; TYPE: TYPE
U3 = LTP5902c:LTP5902
U4 = WINDc:WIND
U5 = SEN0219c:SEN0219
U6 = LM393c:LM393
X1-X3 = con-JST PH:B4B-PH: JST PH series header 2.00mm pitch disconnectable crimp style connectors, vertical (side entry type), 4 pins
Y1 = crystal-geyer_V1_0:KX: Quartz Crystals (MHz) SMD: KX - Serie Model Size l/w/h [mm] Frequency Range Frequency Stability Temp. Range [°C] Load Capacitance AECQ 200 availabel Datasheet KX-4 KX-5 KX-6 KX-7 KX-9A KX-9B KX-12A KX-12B KX-13 KX-20 KX-K KX-KS 1.6/1.2/0.3 2.0/1.6/0.45 2.5/2.0/0.55 3.2/2.5/0.8 5.0/3.2/1.0 5.0/3.2/1.1 6.0/3.5/1.1 6.0/3.5/1.0 7.0/5.0 /1.3 11.6/5.5/1.6 12.3/4.5/4.2 12.3/4.5/3.2 24.0 ~ 80.0 MHz 16.0 ~ 80.0 MHz 12.0 ~ 80.0 MHz 8.0 ~ 60.0 MHz 7,68 ~ 300,0 MHz 8,0 ~ 50,0 MHz 8,0 ~ 150,0 MHz 8,0 ~ 50,0 MHz 6,0 ~ 160,0 MHz 3,579 ~ 25,0 MHz 3,579 ~ 70,0 MHz 3,579 ~ 70,0 MHz ±10 … ±50ppm ±10 … ±50ppm ±10 … ±50ppm ±10 … ±50ppm ±10 … ±50ppm ±10 … ±50ppm ±10 … ±50ppm ±10 … ±50ppm ±10 … ±50ppm ±50ppm ±10 … ±50ppm ±10 … ±50ppm (*) -40°C …+85°C (*) -40°C …+125°C (*) -40°C …+125°C (*) -40°C …+125°C (*) -40°C …+105°C (*) -40°C …+105°C (*) -40°C …+125°C (*) -40°C …+105°C (*) -40°C …+105°C (*) -40°C …+105°C (*) -40°C …+85°C (*) -40°C …+85°C 8, 8…16 8, 8…16 10, 8…16 12, 7…20 16, 10…20 16, 10…20 16, 10…20 16, 12…20 16, 12…20 16, 12…20 16, 12…30 16, 12…30 - yes yes yes - - - - - - - - KX-4.pdf <http://www.geyer-electronic.de/uploads/tx_userartikelfrequenz/GEYER-KX-4.pdf> KX-5.pdf <http://www.geyer-electronic.de/uploads/tx_userartikelfrequenz/GEYER-KX-5.pdf> KX-6.pdf <http://www.geyer-electronic.de/uploads/tx_userartikelfrequenz/GEYER-KX-6.pdf> KX-7.pdf <http://www.geyer-electronic.de/uploads/tx_userartikelfrequenz/GEYER-KX-7.pdf> KX-9A.pdf <http://www.geyer-electronic.de/uploads/tx_userartikelfrequenz/GEYER-KX-9A.pdf> KX-9B.pdf <http://www.geyer-electronic.de/uploads/tx_userartikelfrequenz/GEYER-KX-9B.pdf> KX-12A.pdf <http://www.geyer-electronic.de/uploads/tx_userartikelfrequenz/GEYER-KX-12A.pdf> KX-12B.pdf <http://www.geyer-electronic.de/uploads/tx_userartikelfrequenz/GEYER-KX-12B.pdf> KX-13.pdf <http://www.geyer-electronic.de/uploads/tx_userartikelfrequenz/GEYER-KX-13.pdf> KX-20.pdf <http://www.geyer-electronic.de/uploads/tx_userartikelfrequenz/GEYER-KX-20.pdf> KX-K.pdf <http://www.geyer-electronic.de/uploads/tx_userartikelfrequenz/GEYER-KX-K.pdf> KX-KS.pdf <http://www.geyer-electronic.de/uploads/tx_userartikelfrequenz/GEYER-KX-KS.pdf> <http://www.geyer-electronic.de/fileadmin/template/img/logo-geyer-electronic.png> Details see: http://www.geyer-electronic.de/Frequenz-Produkte.9.0.html Created 2016-06-07, Hans Locher 2016 (C) Geyer Quartz Technology KX4,KX5,KX6,KX7,KX9A,KX9B,KX12A,KX12B,KX13,KX20,KXK,KXKS;1612;2016;2520;3225;5032;6035;7050;11655;12345;1,6x1,2;2,0x1,6;2,5x2,0;3,2x2,5;5,0x3,2;6,0x3,5;7,0x5,0;11,6x5,5;12,3x4,5;12,3x4,5;1.6x1.2;2.0x1.6;2.5x2.0;3.2x2.5;5.0x3.2;6.0x3.5;7.0x5.0;11.6x5.5;12.3x4.5;12.3x4.5;

## Board
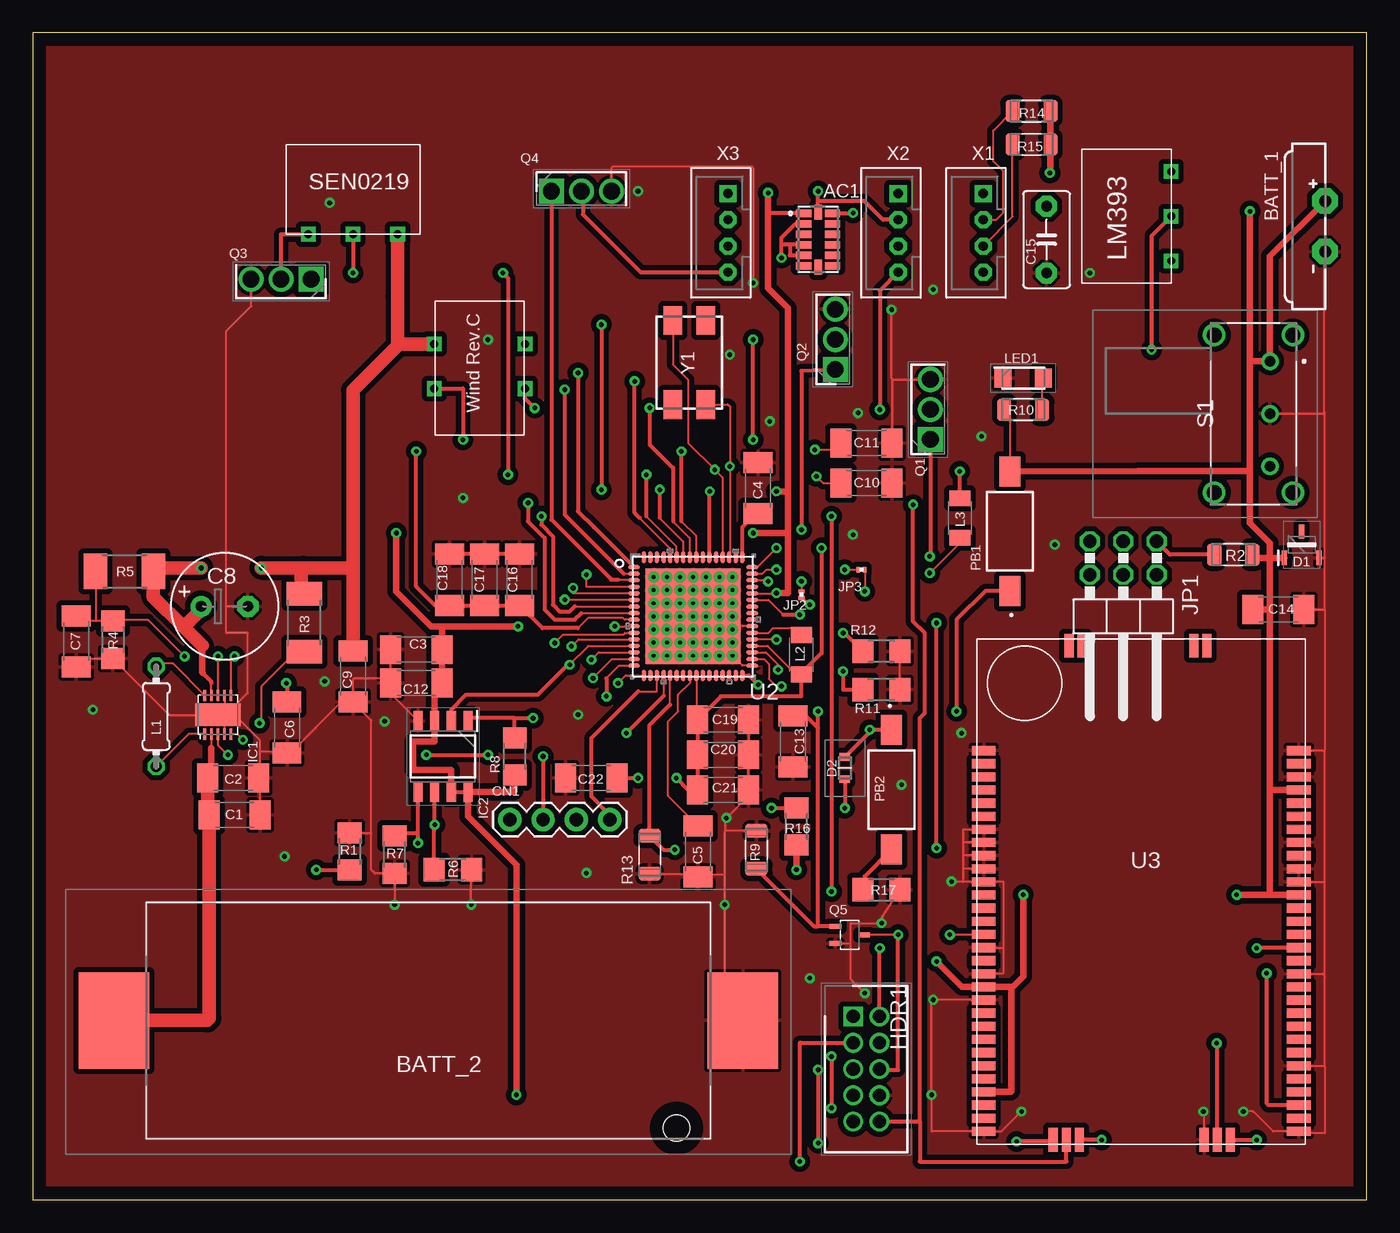
[diagram p4: board, top side]
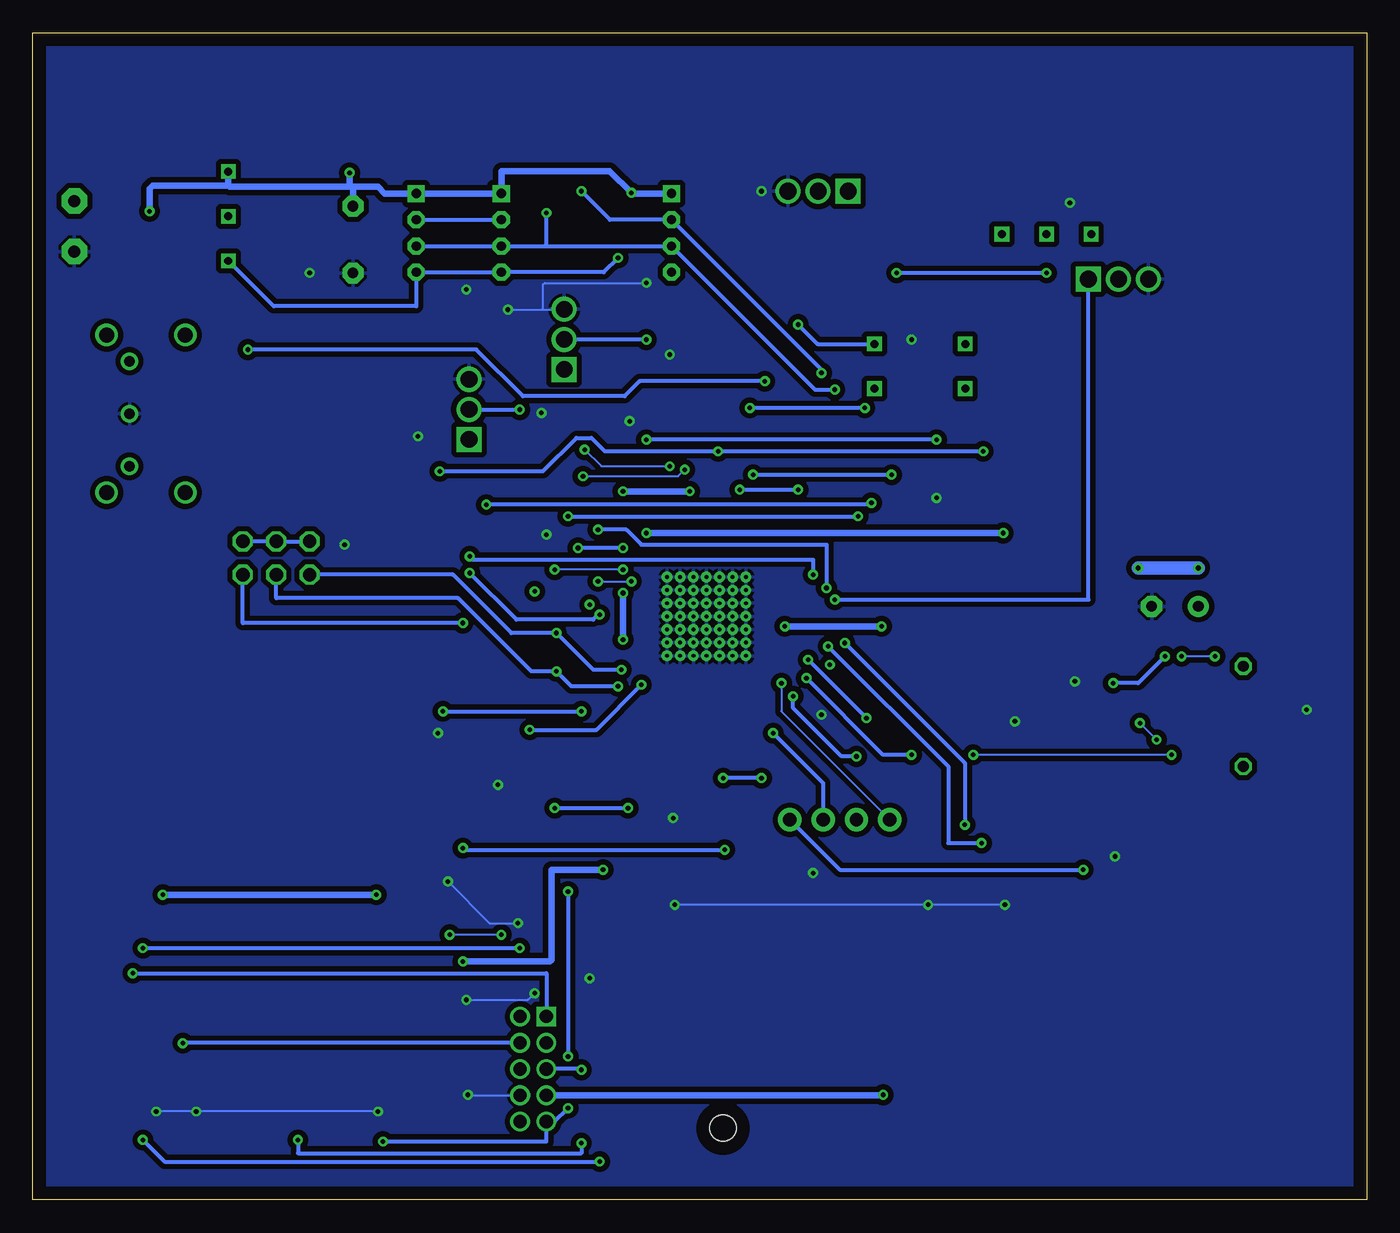
[diagram p5: board, bottom side, seen from below]

Size 101.6 x 88.9 mm. Coordinates in mm from the lower left corner, seen from the top.
Outline: 0,0 101.6,0 101.6,88.9 0,88.9 0,0
Copper layers (1*16): Top 0.035mm / dielectric 1.5mm / Bottom 0.035mm
Design rules "default": minimum track width 6mil, minimum drill 0.35mm, track to track 6mil, track to pad 6mil, pad to pad 6mil, via to via 6mil, smd to smd 6mil, copper to edge 40mil, drill to drill 6mil, minimum pad ring 10mil, minimum via ring 8mil, stop-mask expansion 4mil, vias tented up to drill 0mil, thermal gap 10mil

### Footprints (pad centres in the part's own frame; a part is rotated, then mirrored left to right if it is on the bottom)
CC-14-1 = smd 1.145 x 0.55: 1 -1.097,2; 2 -1.097,1.2; 3 -1.097,0.4; 4 -1.097,-0.4; 5 -1.097,-1.2; 6 -1.097,-2; 8 1.097,-2; 9 1.097,-1.2; 10 1.097,-0.4; 11 1.097,0.4; 12 1.097,1.2; 13 1.097,2 | smd 0.55 x 1.145: 7 0,-2.098; 14 0,2.098
BATTERY_BR1225/FA = drill 0.914 pad 1.93 octagon: + -1.925,1.4; - 1.925,1.4
12BH23PGR = smd 5.35 x 7.35: 1 -23.95,0; 2 23.95,0 | hole 2: -18.9,8.2
C1808 = smd 1.6 x 2.2: 1 -1.95,0; 2 1.95,0
E3,5-8 = drill 0.813 pad 1.6: + -1.778,0 | drill 0.813 pad 1.6 octagon: - 1.778,0
C5B3.5 = drill 0.813 pad 1.6 octagon: 1 -2.54,0; 2 2.54,0
1X04-BIG = drill 1.016 pad 1.778: 1 0,0; 2 2.54,0; 3 5.08,0; 4 7.62,0
SOT132P220X110-3N = smd 1.1 x 0.4: 1 -1,1.32; 2 -1,-1.32; 3 1,0
CD0603B0240R = smd 0.6 x 0.8: 1 -0.85,0; 2 0.85,0
SHDR10W55P200_2X5_1265X630X640 = drill 1 pad 1.5 square: 1 0,0 | drill 1 pad 1.5: 2 0,2; 3 2,0; 4 2,2; 5 4,0; 6 4,2; 7 6,0; 8 6,2; 9 8,0; 10 8,2
S-PWSON-N10 = smd 0.28 x 0.85: 1 -1,-1.475; 2 -0.5,-1.475; 3 0,-1.475; 4 0.5,-1.475; 5 1,-1.475; 6 1,1.475; 7 0.5,1.475; 8 0,1.475; 9 -0.5,1.475; 10 -1,1.475 | smd 3.55 x 1.7: PAD 0,0
SOIC127P600X175-8N = smd 1.525 x 0.7: 1 -2.712,1.905; 2 -2.712,0.635; 3 -2.712,-0.635; 4 -2.712,-1.905; 5 2.712,-1.905; 6 2.712,-0.635; 7 2.712,0.635; 8 2.712,1.905
2X03/90 = drill 1.016 octagon: 1 -2.54,-6.35; 2 -2.54,-3.81; 3 0,-6.35; 4 0,-3.81; 5 2.54,-6.35; 6 2.54,-3.81
R0201 = smd 0.28 x 0.43: 1 -0.255,0; 2 0.255,0
0204/7 = drill 0.813 octagon: 1 -3.81,0; 2 3.81,0
L3216C = smd 1.2 x 1.6: 1 -1.5,0; 2 1.5,0
LEDM3216X130N = smd 1.3 x 1.45: 1 -1.55,0; 2 1.55,0
FSMSM = smd 2.27 x 1.6: 1 -4.55,0; 2 4.55,0
TO229P250X658X985-3P = drill 1.27 pad 1.905 square: 1 0,0 | drill 1.27 pad 1.905: 2 2.29,0; 3 4.58,0
SC70-3_DCK = smd 0.4 x 0.9: 1 0.65,1.1; 2 -0.65,1.1; 3 0,-1.1
R1206 = smd 1.6 x 1.803: 1 -1.422,0; 2 1.422,0
RES_1206 = smd 1.08 x 1.68: 1 -1.445,0; 2 1.445,0
R5025 = smd 1.8 x 2.7: 1 -2.2,0; 2 2.2,0
EG1224 = drill 0.8 pad 1.3: 1 0,0; 2 4,0; 3 8,0 | drill 1.14 pad 1.71: MH1 -2,-4.25; MH2 -2,1.75; MH3 10,1.75; MH4 10,-4.25
RGC0064A = smd 0.9 x 0.3: 1 -4.5,3.75; 2 -4.5,3.25; 3 -4.5,2.75; 4 -4.5,2.25; 5 -4.5,1.75; 6 -4.5,1.25; 7 -4.5,0.75; 8 -4.5,0.25; 9 -4.5,-0.25; 10 -4.5,-0.75; 11 -4.5,-1.25; 12 -4.5,-1.75; 13 -4.5,-2.25; 14 -4.5,-2.75; 15 -4.5,-3.25; 16 -4.5,-3.75; 33 4.5,-3.75; 34 4.5,-3.25; 35 4.5,-2.75; 36 4.5,-2.25; 37 4.5,-1.75; 38 4.5,-1.25; 39 4.5,-0.75; 40 4.5,-0.25; 41 4.5,0.25; 42 4.5,0.75; 43 4.5,1.25; 44 4.5,1.75; 45 4.5,2.25; 46 4.5,2.75; 47 4.5,3.25; 48 4.5,3.75 | smd 0.3 x 0.9: 17 -3.75,-4.5; 18 -3.25,-4.5; 19 -2.75,-4.5; 20 -2.25,-4.5; 21 -1.75,-4.5; 22 -1.25,-4.5; 23 -0.75,-4.5; 24 -0.25,-4.5; 25 0.25,-4.5; 26 0.75,-4.5; 27 1.25,-4.5; 28 1.75,-4.5; 29 2.25,-4.5; 30 2.75,-4.5; 31 3.25,-4.5; 32 3.75,-4.5; 49 3.75,4.5; 50 3.25,4.5; 51 2.75,4.5; 52 2.25,4.5; 53 1.75,4.5; 54 1.25,4.5; 55 0.75,4.5; 56 0.25,4.5; 57 -0.25,4.5; 58 -0.75,4.5; 59 -1.25,4.5; 60 -1.75,4.5; 61 -2.25,4.5; 62 -2.75,4.5; 63 -3.25,4.5; 64 -3.75,4.5 | smd 7.25 x 7.25: 65 0,0 | drill 0.3: V 3,3; V_1 3,1; V_2 -3,2; V_3 -3,0; V_4 -2,2; V_5 -3,3; V_6 -3,1; V_7 -2,3; V_8 -3,-3; V_9 -2,1; V_10 -3,-2; V_11 -3,-1; V_12 2,2; V_13 3,2; V_14 2,1; V_15 -1,1; V_16 0,1; V_17 1,1; V_18 1,3; V_19 -1,3; V_20 0,3; V_21 2,3; V_22 1,2; V_23 -1,2; V_24 0,2; V_25 -2,0; V_26 -1,0; V_27 0,0; V_28 1,0; V_29 2,0; V_30 3,0; V_31 -2,-1; V_32 -2,-2; V_33 -2,-3; V_34 -1,-1; V_35 -1,-2; V_36 -1,-3; V_37 0,-1; V_38 0,-2; V_39 0,-3; V_40 1,-1; V_41 1,-2; V_42 1,-3; V_43 2,-1; V_44 2,-2; V_45 2,-3; V_46 3,-1; V_47 3,-2; V_48 3,-3
LTP5902-MMCX = smd 0.7 x 1.8: M1 -5.4,18.6; M2 -4.4,18.6; M3 4.1,18.6; M4 5.1,18.6; P31 -6.607,-19.043; P32 -5.607,-19.043; P33 -4.607,-19.043; P34 4.893,-19.043; P35 5.893,-19.043; P36 6.893,-19.043 | smd 1.8 x 0.7: P1 -11.9,10.6; P2 -11.9,9.6; P3 -11.9,8.6; P4 -11.9,7.6; P5 -11.9,6.6; P6 -11.9,5.6; P7 -11.9,4.6; P8 -11.9,3.6; P9 -11.9,2.6; P10 -11.9,1.6; P11 -11.9,0.6; P12 -11.9,-0.4; P13 -11.9,-1.4; P14 -11.9,-2.4; P15 -11.9,-3.4; P16 -11.9,-4.4; P17 -11.9,-5.4; P18 -11.9,-6.4; P19 -11.9,-7.4; P20 -11.9,-8.4; P21 -11.9,-9.4; P22 -11.9,-10.4; P23 -11.9,-11.4; P24 -11.9,-12.4; P25 -11.9,-13.4; P26 -11.9,-14.4; P27 -11.9,-15.4; P28 -11.9,-16.4; P29 -11.9,-17.4; P30 -11.9,-18.4; P37 12.1,-18.4; P38 12.1,-17.4; P39 12.1,-16.4; P40 12.1,-15.4; P41 12.1,-14.4; P42 12.1,-13.4; P43 12.1,-12.4; P44 12.1,-11.4; P45 12.1,-10.4; P46 12.1,-9.4; P47 12.1,-8.4; P48 12.1,-7.4; P49 12.1,-6.4; P50 12.1,-5.4; P51 12.1,-4.4; P52 12.1,-3.4; P53 12.1,-2.4; P54 12.1,-1.4; P55 12.1,-0.4; P56 12.1,0.6; P57 12.1,1.6; P58 12.1,2.6; P59 12.1,3.6; P60 12.1,4.6; P61 12.1,5.6; P62 12.1,6.6; P63 12.1,7.6; P64 12.1,8.6; P65 12.1,9.6; P66 12.1,10.6
WIND = drill 0.6 square: P$1 -3.458,1.827; P$2 -3.458,-1.573; P$3 3.458,1.827; P$4 3.458,-1.573
SEN0219 = drill 0.6 square: P$1 3.4,3.4; P$2 3.4,0; P$3 3.4,-3.4
LM393 = drill 0.6 square: P$1 3.4,3.4; P$2 3.4,0; P$3 3.4,-3.4
B4B-PH-K-S = drill 0.7 pad 1.3 square: 1 3,0 | drill 0.7 pad 1.3 octagon: 2 1,0; 3 -1,0; 4 -3,0
7.0X5.0 = smd 2.2 x 1.4: 1 -3.2,-1.25; 2 3.2,-1.25; 3 3.2,1.25; 4 -3.2,1.25

### Placement (x,y rotation side)
AC1  59.82,73.15 0 top
BATT_1  97.03,74.17 270 top
BATT_2  30.13,13.66 180 top
C1  15.37,29.34 0 top
C2  15.27,32.13 0 top
C3  29.21,41.91 180 top
C4  55.24,54.23 90 top
C5  50.67,26.54 270 top
C6  19.35,35.99 270 top
C7  3.3,42.55 270 top
C8  14.61,45.21 0 top
C9  24.38,39.88 270 top
C10  63.5,54.61 0 top
C11  63.5,57.66 0 top
C12  29.21,39.37 180 top
C13  57.91,34.92 270 top
C14  94.87,44.96 0 top
C15  77.22,73.15 270 top
C16  37.08,47.24 90 top
C17  34.42,47.24 90 top
C18  31.75,47.24 90 top
C19  52.58,36.58 0 top
C20  52.58,33.91 0 top
C21  52.58,31.24 0 top
C22  42.55,32.13 180 top
CN1  36.32,28.96 0 top
D1  96.65,49.91 90 top
D2  61.85,32.89 270 top
HDR1  62.48,13.97 270 top
IC1  14.1,36.96 0 top
IC2  31.24,33.78 270 top
JP1  83.06,43.81 180 top
JP2  58.55,46.1 270 top
JP3  63.12,48.01 0 top
L1  9.4,36.83 270 top
L2  58.55,41.53 90 top
L3  70.61,51.94 270 top
LED1  75.44,62.61 0 top
PB1  74.42,50.93 90 top
PB2  65.41,31.24 270 top
Q1  68.37,57.92 90 top
Q2  61.13,63.26 90 top
Q3  21.2,70.14 180 top
Q4  39.5,76.83 0 top
Q5  62.23,20.19 90 top
R1  24.13,26.54 90 top
R2  91.44,49.15 0 top
R3  20.68,43.97 90 top
R4  6.1,42.67 90 top
R5  6.99,47.88 0 top
R6  32,25.15 0 top
R7  27.56,26.29 270 top
R8  36.7,33.78 270 top
R9  55.12,26.67 270 top
R10  75.44,60.2 0 top
R11  64.64,38.86 0 top
R12  64.64,41.78 0 top
R13  46.99,26.29 90 top
R14  76.07,82.93 180 top
R15  76.07,80.39 180 top
R16  58.17,28.45 270 top
R17  64.64,23.62 180 top
S1  94.23,63.88 270 top
U2  50.29,44.45 0 top
U3  84.33,23.62 0 top
U4  34.04,63.37 0 top
U5  24.38,76.96 270 top
U6  83.31,74.93 0 top
X1  72.39,73.66 90 top
X2  65.91,73.66 90 top
X3  52.96,73.66 90 top
Y1  50,63.79 270 top

### Tracks (layer width: path | path; a pad name or v marks a point on that pad's centre or on a via)
+3.3V  (via drill 0.35)
  Top 0.152: v44.32,43.69 45.09,43.69 45.1,43.7 U2.10 | 51.54,53.95 v51.56,53.98 | U2.44 56.61,46.2 v56.64,46.23 | U2.37 56.61,42.7 v56.64,42.67 | 94.23,23.24 94.25,23.22 | R10.1 74.42,59.77 PB1.2
  Top 0.305: U2.54 51.54,53.95 | IC2.7 IC2.8 | 56.01,75.18 58.69,75.18 AC1.1
  Top 0.508: v56.01,76.71 56.01,75.18 56.01,69.47 57.53,67.94 57.53,53.98 | 92.71,55.5 92.71,51.56 94.23,50.04 94.23,48.9 | 94.23,44.96 94.23,48.9 | 94.23,44.96 94.23,31.11 | 94.23,31.11 94.23,23.24 | v92.71,75.31 92.71,63.88 | 92.71,63.88 92.71,55.5 | v56.64,53.98 57.53,53.98 | v56.64,46.23 57.53,46.23 57.53,50.8 | 94.23,44.96 C14.1 | PB1.2 84.18,55.5 92.71,55.5 | R8.2 36.7,31.15 36.62,31.07 IC2.8 33.15,29.21 36.83,25.53 v36.83,8 | 57.53,50.8 57.53,53.98 | IC2.7 31.88,32.77 28.96,32.77 28.96,34.92 30.61,34.92 IC2.3 30.61,38.82 C12.1 C3.1 31.16,43.64 31.11,43.69 | D1.1 94.25,48.91 94.23,48.9 | BATT_1.+ 94.23,71.9 S1.1 92.71,63.88 | 31.11,43.69 30.35,43.69 27.69,46.35 v27.69,50.8 | 31.11,43.69 v36.96,43.69 | v54.86,50.8 57.53,50.8 | 94.23,48.9 93.22,48.9 92.96,48.64 92.89,48.72 R2.2 | R14.1 R15.1 77.52,78.28 v77.47,78.23 | 74.55,16.13 74.46,16.22 U3.P19 70.77,16.22 v68.83,18.16 | 74.55,16.13 74.55,8.26 74.52,8.22 U3.P27 | v91.69,23.24 94.23,23.24 | v75.44,23.24 75.44,17.02 74.55,16.13 | v58.17,25.15 R16.2 | 94.23,23.24 96.41,23.24 U3.P55 | 94.23,31.11 94.34,31.22 U3.P63
  Bottom 0.508: v51.56,53.98 v56.64,53.98 | v56.64,46.23 v56.64,42.67 | 77.6,77.17 86.61,77.17 86.71,77.27 | 77.6,77.17 77.09,77.17 | 77.09,77.17 75.31,77.17 74.8,76.66 X1.1 X2.1 65.91,78.36 57.66,78.36 v56.01,76.71 55.96,76.66 X3.1 | C15.1 77.22,77.04 77.09,77.17 | v44.32,43.69 v36.96,43.69 | v92.71,75.31 92.71,77.04 92.48,77.27 86.71,77.27 | U6.P$1 86.71,77.27 | v54.86,50.8 v27.69,50.8 | HDR1.7 36.86,7.97 v36.83,8 | 77.6,77.17 77.47,77.3 v77.47,78.23 | v91.69,23.24 v75.44,23.24 | v68.83,18.16 62.23,18.16 62.1,18.29 62.1,25.15 v58.17,25.15
+3.6V
  Top 0.152: IC1.2 13.6,34.42
  Top 0.508: 13.6,34.42 13.6,32.41 C2.1 | C1.1 13.31,29.44 13.31,29.59 13.44,29.46
  Top 1.016: BATT_2.2 13.28,13.66 13.44,13.82 13.44,29.46 | C2.1 13.31,29.59
+5V  (via drill 0.35)
  Top 0.152: IC1.9 13.6,39.36
  Top 0.305: 13.6,39.36 13.6,39.49 12.95,40.13
  Top 0.508: 12.95,40.13 12.89,40.2 12.89,42.23
  Top 1.016: 27.78,65.07 24.38,61.67 24.38,47.75 | 24.38,47.75 C9.1 | U5.P$1 27.78,68.83 27.78,65.07 | 12.89,42.23 11.49,43.62 | 11.49,43.62 12.83,44.96 C8.+ | R3.2 20.45,46.4 20.45,48.01 20.57,48.13 | v12.83,48.13 9.44,48.13 R5.2 9.19,45.93 11.49,43.62 | v17.4,48.13 20.57,48.13 | 20.57,48.13 24,48.13 24.38,47.75 | 27.78,65.07 27.91,65.2 U4.P$1
  Bottom 1.016: v12.83,48.13 v17.4,48.13
CC_NRESET  (via drill 0.35)
  Top 0.305: PB2.1 63.78,35.79 v63.75,35.81 63.75,35.65 D2.1 | U2.32 54.54,39.95 v55.24,39.24
  Bottom 0.305: v63.75,35.81 58.67,35.81 v55.24,39.24
D2_P2  (via drill 0.35)
  Top 0.305: D2.2 v61.85,29.84 | v56.26,29.84 58.14,29.84 R16.1
  Bottom 0.305: v61.85,29.84 v56.26,29.84
DC_ANA2  (via drill 0.35)
  Top 0.152: v58.55,47.12 JP2.1 | U2.46 55.92,47.2 v56.01,47.12
  Bottom 0.152: v58.55,47.12 v56.01,47.12
DC_DIGSW  (via drill 0.35)
  Top 0.152: U2.43 56.03,45.7 57.15,44.58 | v68.33,47.75 70.61,50.04 L3.2
  Top 0.305: 57.15,44.58 v58.42,44.58
  Bottom 0.305: v58.42,44.58 58.55,44.58 58.93,44.2 64.77,44.2 v68.33,47.75
FB_TPS  (via drill 0.35)
  Top 0.152: 4.83,44.09 R4.2 6.05,44.17 8.79,44.17 v11.56,41.4 | 4.83,44.09 3.7,44.09 C7.1 | v14.1,41.4 IC1.8 | 4.83,44.09 4.79,44.13 R5.1
  Bottom 0.152: v11.56,41.4 v14.1,41.4
FLASH_P_ENN  (via drill 0.35)
  Top 0.305: v93.22,19.18 93.26,19.22 U3.P51 | v64.52,19.18 64.48,19.14 HDR1.2
  Bottom 0.305: v64.52,19.18 v93.22,19.18
FLS_SPI_CLK  (via drill 0.35)
  Top 0.152: v39.75,42.42 40.39,43.05 44.96,43.05 45.1,43.2 U2.11
  Top 0.305: IC2.6 v30.61,28.57 30.58,28.55 R6.1
  Bottom 0.305: v30.61,28.57 30.61,33.27 v39.75,42.42
FLS_SPI_CS  (via drill 0.35)
  Top 0.152: v42.55,41.15 43.1,41.7 U2.14
  Top 0.305: R8.1 36.7,36.7 | 36.7,36.7 v38.1,36.7 | 36.7,36.7 33.36,36.7 IC2.1
  Bottom 0.305: v42.55,41.15 v38.1,36.7
FLS_SPI_DIN  (via drill 0.35)
  Top 0.152: v40.89,40.77 42.33,42.2 U2.13
  Top 0.305: IC2.2 31.88,37.34 33.02,38.48 38.48,38.48 40.77,40.77 v40.89,40.77
FLS_SPI_DOUT  (via drill 0.35)
  Top 0.152: v41.02,42.16 41.56,42.7 U2.12
  Top 0.305: v29.34,27.18 29.34,27.94 | 29.34,27.94 IC2.5 | R7.1 27.79,27.94 29.34,27.94
  Bottom 0.305: v29.34,27.18 31.88,27.18 31.88,33.02 v41.02,42.16
GND  (via drill 0.35)
  Top 0.152: IC1.4 14.6,36.19 14.73,36.32 IC1.PAD | IC1.7 14.6,37.73 14.73,37.59 IC1.PAD | IC1.PAD 15.37,36.96 17.27,35.05 17.27,34.16 | IC1.PAD 14.73,36.96 16.38,38.61 16.38,43.18 14.73,43.18 14.73,45.21 | C6.2 19.36,33.78 19.58,34.01 | C9.2 23.5,37.93 19.58,34.01 | 19.58,34.01 19.3,34.01 19.15,34.16 17.27,34.16 | U3.P42 98.36,10.22 98.42,10.16 | 98.42,10.16 98.42,5.08 96.57,5.08 U3.P37 94.47,5.22 92.96,6.73 v92.2,6.73 | U3.P49 98.22,17.22 98.42,17.02 | 98.42,10.16 98.42,17.02 | 98.42,17.02 98.42,24.26 | 98.42,24.26 98.42,34.29 | 98.42,44.96 98.42,34.29 | 98.42,34.29 98.36,34.22 U3.P66 | v75.31,6.73 73.79,5.21 73.77,5.22 U3.P30 68.45,5.22 v68.45,8 68.45,15.08 68.6,15.22 | U3.P1 72.52,34.22 | U3.P34 89.22,6.66 v89.15,6.73 | IC1.PAD 10.39,36.96 R4.1 3.96,41.25 C7.2 | BATT_2.1 52.7,15.04 v52.7,22.48 52.7,24.77 | 52.7,24.77 52.7,28.07 | 52.7,28.07 52.7,28.96 v52.83,29.08 54.53,30.78 C21.2 C20.2 C19.2 | C11.2 65.45,62.48 65.53,62.48 | 65.53,62.48 68.4,62.48 Q1.3 | C14.2 98.42,44.96 | U3.P20 68.6,15.22 | R9.1 52.8,28.11 52.7,28.07 | 98.42,44.96 98.42,48.91 | C9.2 24.38,39.62 24.51,39.75 26.88,39.75 C12.2 | v27.56,22.48 R7.2 26.06,24.87 25.78,25.15 25.78,27.94 | v33.4,22.48 33.4,25.12 | 25.78,27.94 25.78,36.53 C9.2 | D1.2 98.42,48.91 | 65.53,62.48 65.41,62.61 v65.41,67.82 | C8.- 14.73,45.21 | 14.73,45.21 14.73,66.17 16.64,68.07 16.64,70.12 Q3.3 | Q4.3 44.08,78.62 44.2,78.74 54.74,78.74 54.86,78.61 v54.86,69.85 | U3.P56 98.39,24.22 98.42,24.26 | 98.42,48.91 98.42,59.94 98.36,59.88 | S1.2 98.36,59.88 | Q5.2 62.31,19.54 | 52.7,24.77 51.61,24.77 C5.2 50.42,24.84 R13.1 | 70.87,24.22 U3.P11 72.46,24.26 73.91,24.26 73.91,19.18
  Top 0.152: 70.87,24.22 70.01,24.22 v69.98,24.26 | 98.36,59.88 98.36,72.18 BATT_1.- | C1.2 17.32,32.03 C2.2 17.27,32.19 17.27,34.16 | R11.2 R12.2 | 70.87,24.22 70.87,25.27 | 70.87,25.27 70.87,26.29 | 70.87,26.29 70.87,27.3 | 70.87,27.3 70.87,28.19 70.89,28.22 U3.P7 | U3.P8 70.95,27.22 70.87,27.3 | U3.P9 70.93,26.22 70.87,26.29 | U3.P10 70.92,25.22 70.87,25.27 | 73.91,19.18 72.47,19.18 U3.P16 | 73.91,19.18 73.91,17.27 72.48,17.27 U3.P18 | v68.58,15.24 68.6,15.22 | R1.2 25.76,27.96 25.78,27.94 | C13.2 57.4,33.48 | IC2.4 27.26,38.57 C12.2 | C12.2 C3.2 | 62.31,19.54 62.31,16.81 v63.37,15.75 | 62.31,19.54 62.31,21.08 v64.64,21.08 64.64,21.44 R17.1 | U2.39 53.54,43.7 U2.V_46 | U2.33 54.04,40.7 U2.V_48
  Top 0.305: 33.4,25.12 R6.2 | C16.2 C17.2 C18.2
  Bottom 0.152: v75.31,6.73 v89.15,6.73 v92.2,6.73 | v27.56,22.48 v33.4,22.48 v52.7,22.48 | v65.41,67.82 62.74,67.82 | 62.74,67.82 61.15,67.82 Q2.3 | 62.74,67.82 62.74,69.72 62.61,69.85 v54.86,69.85 | v69.98,24.26 66.8,21.08 v64.64,21.08 | v68.58,15.24 63.88,15.24 v63.37,15.75 | v68.45,8 68.42,7.97 HDR1.8
  other vias: 70.74,35.56 22.61,75.95 46.1,76.83 53.09,64.39 68.58,69.34 80.52,70.61 72.26,58.17 77.85,49.91 59.18,16.89 42.16,24.89 19.18,26.16 4.57,37.34 22.23,39.5 26.8,36.45 32.77,53.47 62.48,50.67 66.17,31.62 41.53,36.96 34.67,65.53 62.87,59.94 56.13,59.31
  pour Bottom (isolate 0.406): 0,0 0,88.9 101.6,88.9 101.6,0
  pour Top (isolate 0.406): 0,0 0,88.9 101.6,88.9 101.6,0
GPIO2  (via drill 0.35)
  Top 0.152: 48.77,51.69 50.04,50.42 U2.57
  Top 0.305: v38.23,60.33 37.47,61.09 37.47,61.77 U4.P$4 | v46.99,60.33 46.99,57.53 48.77,55.75 48.77,51.69
  Bottom 0.305: v38.23,60.33 v46.99,60.33
GPIO3  (via drill 0.35)
  Top 0.152: U2.58 49.53,48.96 49.53,50.16 47.75,51.94
  Top 0.305: v43.31,66.67 v43.31,54.1 | v47.75,54.1 47.75,51.94
  Bottom 0.305: v43.31,66.67 41.83,65.2 U4.P$3 | v47.75,54.1 v43.31,54.1
GPIO4  (via drill 0.35)
  Top 0.152: 46.74,52.07 49.02,49.78 49.02,48.97 U2.59
  Top 0.305: U5.P$2 v24.38,70.61 | v35.81,70.61 36.2,70.23 v36.2,55.24 | 46.74,52.07 v46.74,55.24
  Bottom 0.305: v24.38,70.61 v35.81,70.61 | v46.74,55.24 v36.2,55.24
GPIO5  (via drill 0.35)
  Top 0.152: U2.60 48.54,49.63 46.23,51.94
  Top 0.305: 46.23,51.94 45.85,52.32 v45.85,62.36 | v85.22,64.77 85.22,73.44 U6.P$2
  Bottom 0.305: v45.85,62.36 55.37,62.36 56.52,61.21 64.26,61.21 67.82,64.77 v85.22,64.77
GPIO12
  Top 0.152: U2.3 44.62,47.2 44.58,47.24
  Top 0.305: Q4.1 39.5,51.82 44.07,47.24 44.58,47.24
GPIO13  (via drill 0.35)
  Top 0.152: U2.4 42.16,46.7 v42.16,47.62
  Top 0.305: Q1.1 68.37,49.07 v68.33,49.02
  Bottom 0.305: v68.33,49.02 68.33,48.9 68.2,48.77 42.16,48.77 v42.16,47.62
GPIO14  (via drill 0.35)
  Top 0.152: U2.5 41.15,46.2 v41.15,46.61
  Top 0.305: Q2.1 58.54,63.15 v58.54,51.06 v58.55,51.05
  Bottom 0.305: v58.55,51.05 56.39,51.05 55.24,49.91 41.15,49.91 v41.15,46.61
GPIO15  (via drill 0.35)
  Top 0.152: U2.6 40.53,45.7 v40.51,45.72
  Bottom 0.305: v40.51,45.72 21.2,45.72 Q3.1
GPIO22  (via drill 0.35)
  Top 0.152: IC1.3 14.1,34.67 v14.86,33.91 | v42.67,39.75 44.12,41.2 U2.15
  Top 0.305: v29.97,33.91 v34.67,33.91
  Bottom 0.152: v14.86,33.91 v29.97,33.91
  Bottom 0.305: v34.67,33.91 36.83,33.91 v42.67,39.75
GPIO31  (via drill 0.35)
  Top 0.305: v59.18,45.34 59.12,45.28 JP2.2
IPCS_MISO  (via drill 0.35)
  Top 0.305: v81.41,4.57 U3.P33 | v59.82,9.91 v59.82,4.32
  Bottom 0.305: v81.41,4.57 81.41,3.56 59.82,3.56 v59.82,4.32 | v59.82,9.91 59.88,9.97 HDR1.5
IPCS_MOSI  (via drill 0.35)
  Top 0.305: U3.P35 90.22,11.89 v90.17,11.94
  Bottom 0.305: HDR1.4 90.14,11.97 v90.17,11.94
IPCS_SCK  (via drill 0.35)
  Top 0.305: v93.22,4.57 v93.21,4.58 U3.P36 | v58.42,2.92 58.42,11.94 58.45,11.97 HDR1.3
  Bottom 0.305: v93.22,4.57 91.57,2.92 v58.42,2.92
IPCS_SSN  (via drill 0.35)
  Top 0.305: U3.P39 94.12,7.22 93.98,7.37 v93.98,17.27
  Bottom 0.305: v93.98,17.27 62.48,17.27 HDR1.1
JP1_PWR
  Top 0.305: R2.1 86.61,49.15 JP1.1
  Bottom 0.305: JP1.1 JP1.3 JP1.5
L2_ANA
  Top 0.152: U2.38 56.03,43.2 56.39,43.56 58.02,43.56 L2.2
L_TPS1
  Top 0.152: IC1.1 11.86,35.48 L1.2
L_TPS2
  Top 0.152: IC1.10 10.68,40.84 9.6,40.84 L1.1
LED1
  Top 0.152: R10.2 76.88,62.51 LED1.2
PB2_2
  Top 0.305: R17.2 63.36,23.62 63.37,24.53 63.37,24.66 PB2.2
PG_TPS  (via drill 0.35)
  Top 0.152: v16,35.05 15.57,35.48 IC1.5 | v17.27,36.32 17.4,36.45 17.4,39.13 20.04,41.77 R3.1
  Bottom 0.152: v17.27,36.32 v16,35.05
Q1+  (via drill 0.35)
  Top 0.152: 57.04,72.75 57.02,72.77
  Top 0.305: AC1.5 57.66,71.95 57.66,72.75 | v57.02,71.75 57.02,72.77 57.02,73.28 58.1,74.35 AC1.2 | AC1.4 57.66,72.75 | 57.66,72.75 57.04,72.75 | X2.4 64.52,69.26 v64.52,60.2
  Bottom 0.305: v57.02,71.75 58.12,70.66 X2.4 X1.4 72.39,68.07 83.25,68.07 U6.P$3 | Q1.2 64.53,60.21 v64.52,60.2
Q2+  (via drill 0.35)
  Top 0.305: U4.P$2 32.77,61.8 v32.77,57.91 | v54.86,57.91 v54.86,65.53
  Bottom 0.305: v32.77,57.91 v54.86,57.91 | v54.86,65.53 61.11,65.53 Q2.2
Q3+
  Top 0.305: U5.P$3 20.95,73.53 18.91,73.53 Q3.2
Q4+
  Top 0.305: Q4.2 41.91,76.71 41.91,75.06 46.31,70.66 X3.4
RESETN  (via drill 0.35)
  Top 0.152: Q5.3 63.36,20.22 65.88,20.22 v65.91,20.19 | v69.85,20.19 69.88,20.22 72.64,20.22
  Top 0.305: U3.P15 72.64,20.22 | HDR1.6 64.55,9.91 65.91,9.91 v65.91,20.19
  Bottom 0.152: v65.91,20.19 v69.85,20.19
RST_BTN  (via drill 0.35)
  Top 0.305: Q5.1 59.82,20.84 | 59.82,20.84 59.82,35.94 | 59.82,35.94 v59.82,37.21 | PB1.1 72.54,46.38 70.36,44.2 v70.36,37.21 | C13.1 58.88,36.88 59.82,35.94 | R9.2 59.5,20.84 59.82,20.84
  Bottom 0.305: v70.36,37.21 v59.82,37.21
SCL  (via drill 0.35)
  Top 0.152: 42.74,51.25 42.73,51.25 | X1.2 72.41,74.68 73.41,74.68 73.91,75.18 73.91,78.36 73.15,79.12 73.15,81.45 R14.2
  Top 0.305: v41.53,62.99 41.53,52.45 42.73,51.25 | AC1.14 59.82,76.07 | X2.2 64.77,74.66 63.36,76.07 59.82,76.07 | 42.74,51.25 U2.1 | 59.82,76.07 v59.82,76.83
  Bottom 0.152: 41.53,63.23 v41.53,62.99
  Bottom 0.305: X1.2 X2.2 | 41.53,63.23 X3.2 57.64,74.66 v59.82,76.83
SDA  (via drill 0.35)
  Top 0.152: 45.01,47.7 U2.2 | X1.3 74.63,74.9 R15.2
  Top 0.305: v40.51,61.72 40.51,52.2 45.01,47.7 | v62.48,75.18 62.45,75.15 AC1.13
  Bottom 0.305: X1.3 X2.3 62.61,72.66 | v40.51,61.72 42.02,61.72 X3.3 62.61,72.66 | 62.61,72.66 62.48,72.79 v62.48,75.18
SOP0  (via drill 0.35)
  Top 0.152: U2.35 55.84,41.7 56.77,40.77 v56.77,40.39
  Top 0.305: R12.1 61.82,43.18 v61.72,43.18
  Bottom 0.305: v56.77,40.39 58.93,40.39 v61.72,43.18 65.15,43.18 69.6,47.62 JP1.6
SOP1  (via drill 0.35)
  Top 0.152: U2.34 55.68,41.2 56.06,40.82 56.06,39.7 56.64,39.12 v57.02,39.12
  Top 0.305: R11.1 61.72,38.86 v61.72,40.26
  Bottom 0.305: v57.02,39.12 60.58,39.12 v61.72,40.26 63.63,40.26 69.22,45.85 83.06,45.85 JP1.4
SOP2  (via drill 0.35)
  Top 0.152: 48.54,37.72 U2.21
  Top 0.305: v48.9,26.67 48.05,26.67 R13.2 46.99,36.19 48.52,37.72 48.54,37.72 | v68.83,26.8 v68.83,43.94
  Bottom 0.305: v68.83,26.8 68.71,26.67 v48.9,26.67 | v68.83,43.94 85.6,43.94 JP1.2
TCK  (via drill 0.35)
  Top 0.152: U2.19 47.54,38.73 46.1,38.73
  Top 0.305: v21.59,25.15 24.11,25.15 R1.1 | CN1.4 43.94,29.34 42.55,30.73 42.55,35.18 46.1,38.73
  Bottom 0.305: v21.59,25.15 40.13,25.15 CN1.4
TDI  (via drill 0.35)
  Top 0.152: 43.69,39.75 44.64,40.7 U2.16
  Top 0.305: v38.86,33.78 CN1.2 | 43.69,39.75 v43.69,38.35
  Bottom 0.305: v38.86,33.78 40.01,33.78 43.69,37.47 v43.69,38.35
TDO  (via drill 0.35)
  Top 0.152: v44.58,39.37 45.16,39.95 U2.17
  Bottom 0.152: v44.58,39.37 44.58,37.21 CN1.1
TMS  (via drill 0.35)
  Top 0.152: U2.20 48.04,38.39
  Top 0.305: 48.04,38.39 v45.21,35.56
  Bottom 0.305: CN1.3 41.4,31.75 v45.21,35.56
UARTC0_RX  (via drill 0.35)
  Top 0.152: 41.78,44.7 U2.8
  Top 0.305: v37.72,53.09 37.72,51.69 38.99,50.42 38.99,44.96 39.75,44.2 41.27,44.2 41.78,44.7 | U3.P32 78.74,4.56 78.74,2.92 67.56,2.92 67.56,5.97 | HDR1.10 67.56,5.97 | 67.56,5.97 67.56,36.7 67.94,37.08 67.94,43.18 67.06,44.07 v67.06,52.96
  Bottom 0.305: v67.06,52.96 37.85,52.96 v37.72,53.09
UARTC0_TX  (via drill 0.35)
  Top 0.152: 41.27,45.21 45.78,45.21
  Top 0.305: v38.73,52.07 38.73,51.44 39.62,50.55 39.62,45.34 40.13,44.83 40.89,44.83 41.27,45.21 | 45.78,45.21 U2.7 | U3.P31 77.59,4.45 v74.93,4.45 | v60.83,52.07 v60.83,23.5 | v60.83,10.92 v60.83,6.99
  Bottom 0.305: v60.83,52.07 v38.73,52.07 | v74.93,4.45 62.48,4.45 HDR1.9 61.85,5.97 v60.83,6.99 | v60.83,23.5 v60.83,10.92
VAUX_TPS  (via drill 0.35)
  Top 0.152: IC1.6 15.1,41.13 v15.37,41.4
  Top 0.305: v19.3,39.37 19.36,39.32 C6.1
  Bottom 0.305: v15.37,41.4 17.4,39.37 v19.3,39.37
VCC_DCDC  (via drill 0.35)
  Top 0.152: JP3.2 v63.37,46.36 v63.37,46.35
VDD_ANA1  (via drill 0.35)
  Top 0.152: U2.36 55.97,42.2 57.91,40.26 58.32,40.26 58.49,40.08 L2.1 | U2.48 55.19,48.2 v56.64,49.66 | U2.25 50.54,36.66 C19.1
  Top 0.305: v49.02,32.13 49.91,31.24 C21.1 C20.1 50.63,36.45 C19.1 52.41,38.35 58.55,38.35 L2.1 | C22.1 v46.1,32.13 | v60.07,49.66 60.07,41.65 58.5,40.08 58.49,40.08
  Bottom 0.305: v46.1,32.13 v49.02,32.13 | v56.64,49.66 v60.07,49.66
VDD_ANA2  (via drill 0.35)
  Top 0.152: U2.47 55.57,47.7 55.88,48.01 v56.64,48.01 | v61.85,48.01 JP3.1
  Bottom 0.152: v56.64,48.01 v61.85,48.01
VDD_DIG  (via drill 0.35)
  Top 0.152: U2.9 45.08,44.2 44.96,44.32 42.29,44.32 41.53,43.56 | U2.56 50.54,50.55 49.4,51.69
  Top 0.305: 41.53,43.56 38.82,43.56 C16.1 C17.1 C18.1 30.65,45.29 29.21,46.74 v29.21,57.02 | 49.4,51.69 v49.4,57.02 | L3.1 v70.61,55.5
  Bottom 0.305: v29.21,57.02 v49.4,57.02 58.04,57.02 59.05,58.04 60.2,58.04 62.74,55.5 v70.61,55.5
VDD_PULL
  Top 0.152: U2.24 50.04,39.37 49.15,38.48 49.15,37.21 48.39,36.45 48.39,30.78 C5.1
VDD_RAM
  Top 0.305: U2.49 54.04,51.25 55.07,52.28 C4.1
XTAL1  (via drill 0.35)
  Top 0.152: v59.56,57.15 61.04,57.15 C11.1 | Y1.3 52.95,60.59 53.09,60.45 v53.09,55.88 53.09,48.99 U2.51
  Bottom 0.152: v53.09,55.88 58.29,55.88 v59.56,57.15
XTAL2  (via drill 0.35)
  Top 0.152: Y1.1 48.75,63.64 49.91,62.48 49.91,57.66 v51.94,55.63 52.54,55.03 U2.52 | v59.69,55.12 60.2,54.61 C10.1
  Bottom 0.152: v59.69,55.12 52.45,55.12 v51.94,55.63